# Altium project MainBoard.PrjPcb
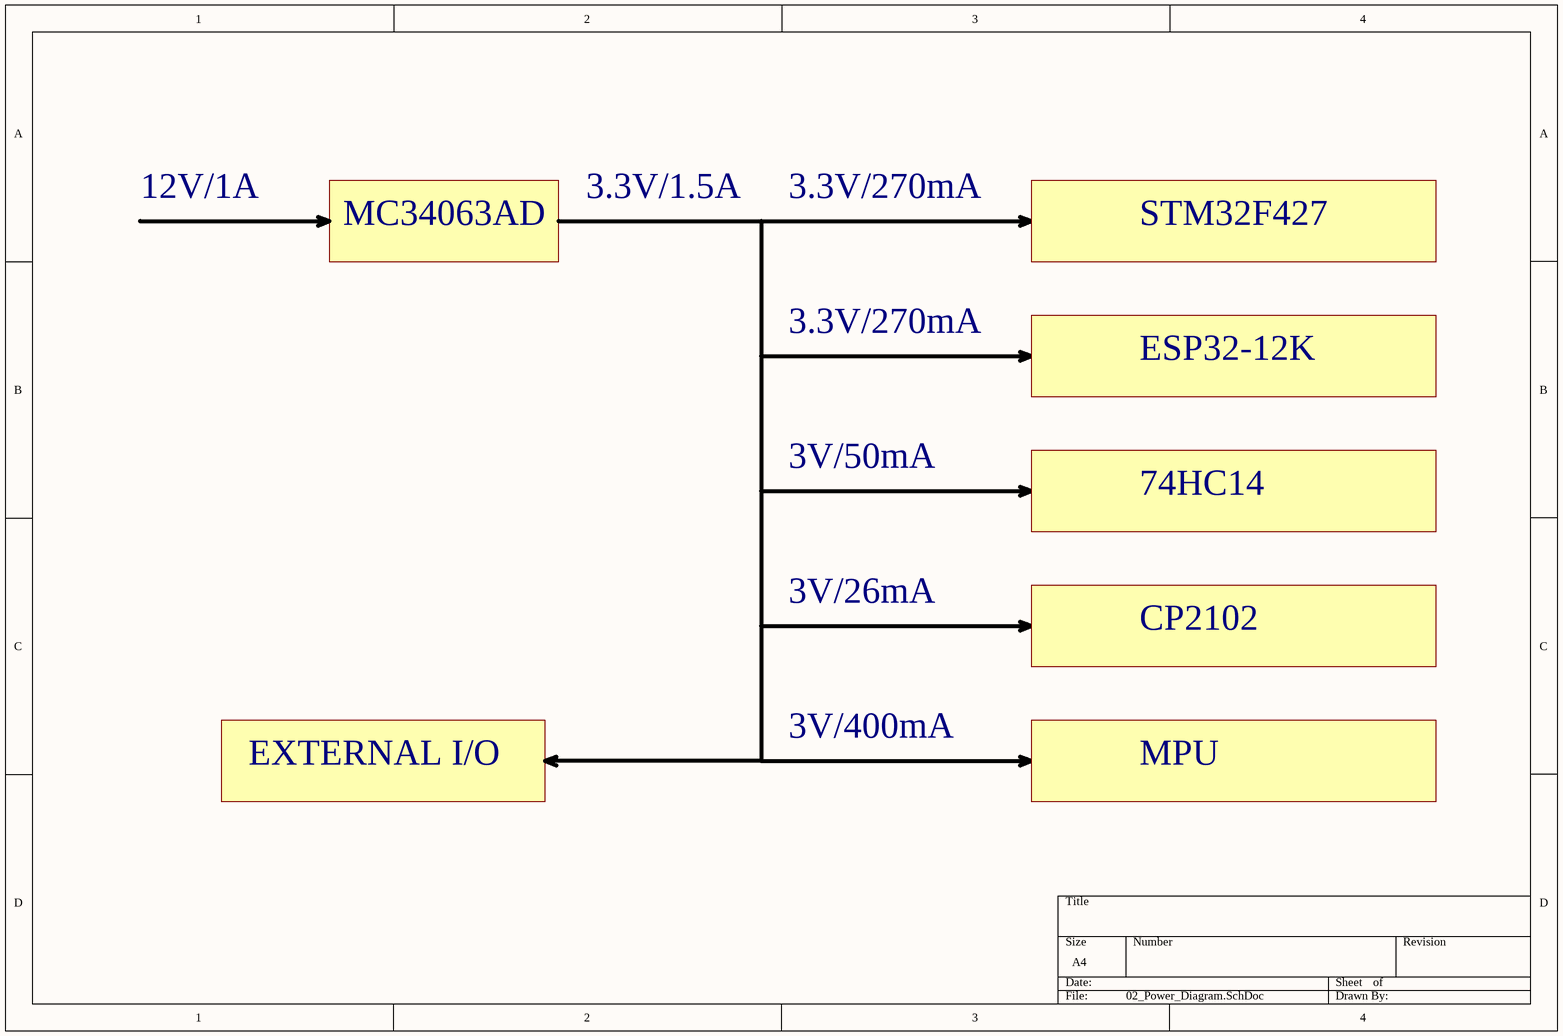
[diagram p0: 02_Power_Diagram.SchDoc]
9 sheets, 197 parts. Net scope: flat (ports and power ports of the same name join across sheets).
Board file: v1.0.PcbDoc
Sheets:
  02_Power_Diagram.SchDoc
  03_MCU_ESP32_Interface.SchDoc
  04_ESP32_UART.SchDoc
  05_MCU_STM32F4_Interface.SchDoc
  06_STM43F4_UART.SchDoc
  07_Ethernet_Interface.SchDoc
  08_Power_Supply.SchDoc
  09_IO_Isolated_Interface.SchDoc
  10_CAN_Interface.SchDoc

## Sheet 02_Power_Diagram.SchDoc
size A4; SheetNumber: 1; SheetTotal: 8

### Notes on the sheet
- 12V/1A
- MC34063AD
- 3.3V/1.5A
- 3.3V/270mA
- STM32F427
- ESP32-12K
- 3V/50mA
- 74HC14
- 3V/26mA
- CP2102
- EXTERNAL I/O
- 3V/400mA
- MPU

## Sheet 03_MCU_ESP32_Interface.SchDoc
size A4; SheetNumber: 4; SheetTotal: 9
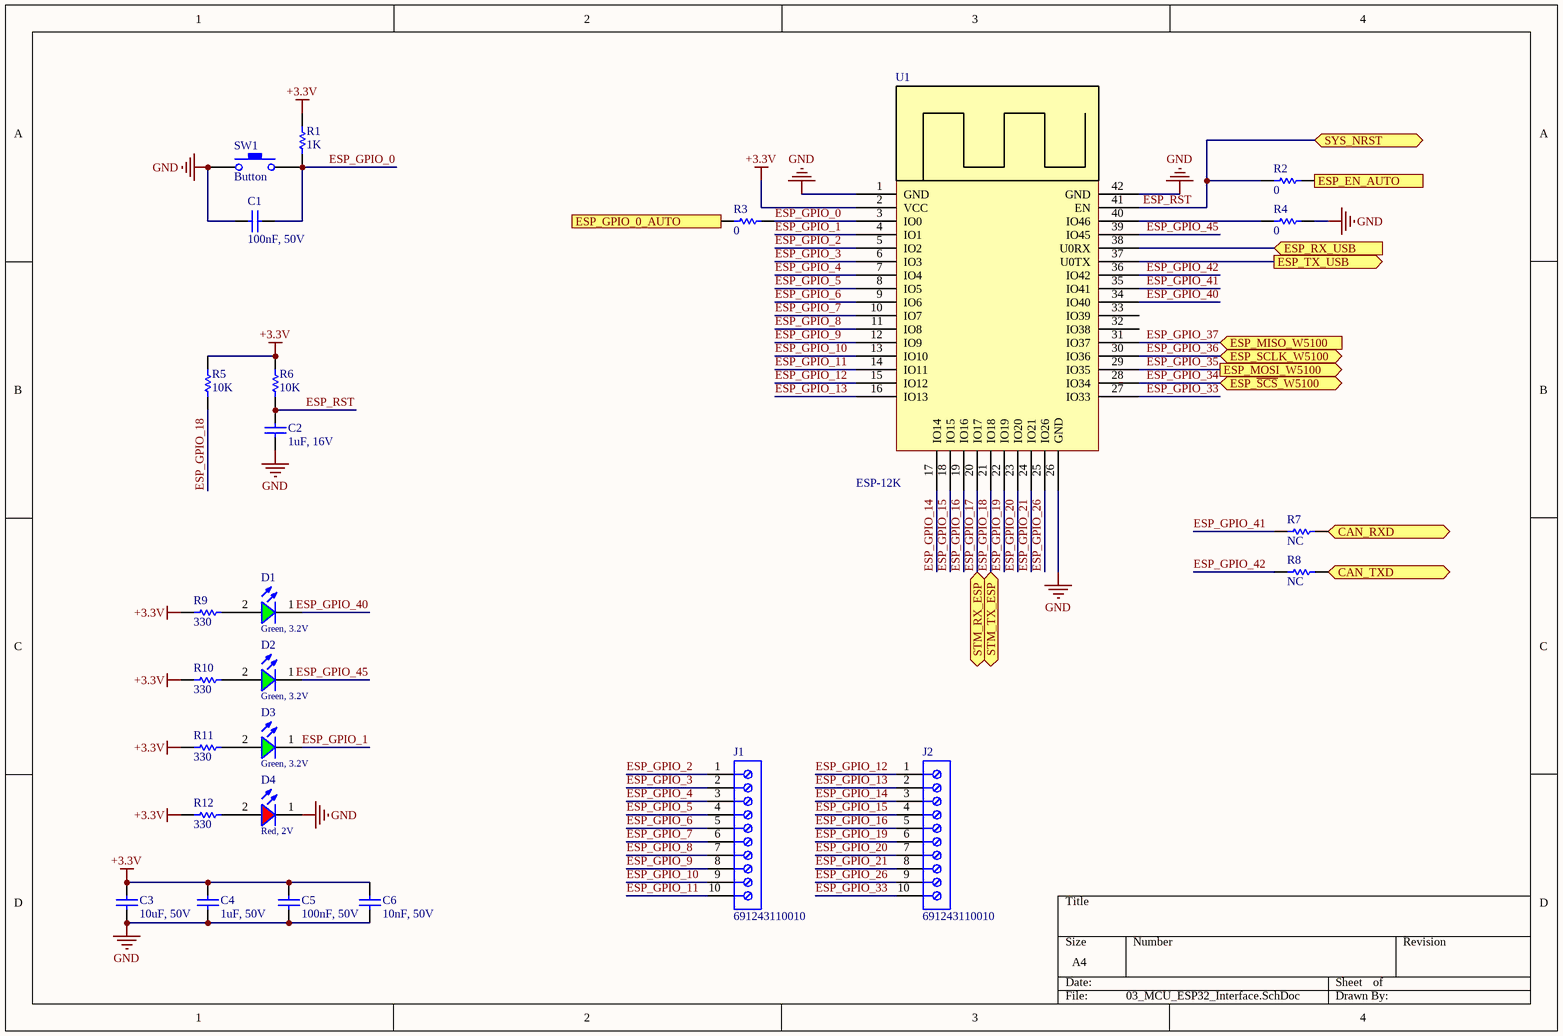
[diagram p1: 03_MCU_ESP32_Interface.SchDoc]

### Parts
C1  100nF, 50V  [WCAP-CSGP_0603_H=0.8mm_Reflow]
C2  1uF, 16V  [WCAP-CSGP_0603_H=0.8mm_Reflow]
C3  10uF, 50V  [WCAP-CSGP_0603_H=0.8mm_Reflow]
C4  1uF, 50V  [WCAP-CSGP_0603_H=0.8mm_Reflow]
C5  100nF, 50V  [WCAP-CSGP_0603_H=0.8mm_Reflow]
C6  10nF, 50V  [WCAP-CSGP_0603_H=0.8mm_Reflow]
D1  Green, 3.2V  [WL-SMCW_0603_H=0.7mm]
D2  Green, 3.2V  [WL-SMCW_0603_H=0.7mm]
D3  Green, 3.2V  [WL-SMCW_0603_H=0.7mm]
D4  Red, 2V  [WL-SMCW_0603_H=0.7mm]
J1  691243110010  [691243110010]
J2  691243110010  [691243110010]
R1  value 1K  [RES-SM-0603]  (hidden comment: RESISTOR SMD)
R2  value 0  [RES-SM-0603]  (hidden comment: RESISTOR SMD)
R3  value 0  [RES-SM-0603]  (hidden comment: RESISTOR SMD)
R4  value 0  [RES-SM-0603]  (hidden comment: RESISTOR SMD)
R5  value 10K  [RES-SM-0603]  (hidden comment: RESISTOR SMD)
R6  value 10K  [RES-SM-0603]  (hidden comment: RESISTOR SMD)
R7  value NC  [RES-SM-0603]  (hidden comment: RESISTOR SMD)
R8  value NC  [RES-SM-0603]  (hidden comment: RESISTOR SMD)
R9  value 330  [RES-SM-0603]  (hidden comment: RESISTOR SMD)
R10  value 330  [RES-SM-0603]  (hidden comment: RESISTOR SMD)
R11  value 330  [RES-SM-0603]  (hidden comment: RESISTOR SMD)
R12  value 330  [RES-SM-0603]  (hidden comment: RESISTOR SMD)
SW1  Button  [Button 4-pin SMD]
U1  ESP-12K  [CAC-150P3100X1800-41N]

### Ports
CAN_RXD (bidir), CAN_TXD (bidir), ESP_EN_AUTO (in), ESP_GPIO_0_AUTO (in), ESP_MISO_W5100 (in), ESP_MOSI_W5100 (out), ESP_RX_USB (in), ESP_SCLK_W5100 (bidir), ESP_TX_USB (out), ESP_~{SCS}_W5100 (bidir), STM_RX_ESP (bidir), STM_TX_ESP (bidir), SYS_NRST (bidir)

### Nets
+3.3V: C3.2 C4.2 C5.2 C6.2 R1.2 R5.2 R6.2 R9.2 R10.2 R11.2 R12.2 U1.2(VCC)
GND: C1.1 C2.1 C3.1 C4.1 C5.1 C6.1 D4.1(K) R4.2 SW1.1 U1.1(GND) U1.26(GND) U1.42(GND)
ESP_GPIO_0: C1.2 R1.1 R3.1 SW1.2 U1.3(IO0)
ESP_GPIO_1: D3.1(K) U1.4(IO1)
ESP_GPIO_2: J1.1 U1.5(IO2)
ESP_GPIO_3: J1.2 U1.6(IO3)
ESP_GPIO_4: J1.3 U1.7(IO4)
ESP_GPIO_5: J1.4 U1.8(IO5)
ESP_GPIO_6: J1.5 U1.9(IO6)
ESP_GPIO_7: J1.6 U1.10(IO7)
ESP_GPIO_8: J1.7 U1.11(IO8)
ESP_GPIO_9: J1.8 U1.12(IO9)
ESP_GPIO_10: J1.9 U1.13(IO10)
ESP_GPIO_11: J1.10 U1.14(IO11)
ESP_GPIO_12: J2.1 U1.15(IO12)
ESP_GPIO_13: J2.2 U1.16(IO13)
ESP_GPIO_14: J2.3 U1.17(IO14)
ESP_GPIO_15: J2.4 U1.18(IO15)
ESP_GPIO_16: J2.5 U1.19(IO16)
ESP_GPIO_17: U1.20(IO17) ; port STM_RX_ESP
ESP_GPIO_18: R5.1 U1.21(IO18) ; port STM_TX_ESP
ESP_GPIO_19: J2.6 U1.22(IO19)
ESP_GPIO_20: J2.7 U1.23(IO20)
ESP_GPIO_21: J2.8 U1.24(IO21)
ESP_GPIO_26: J2.9 U1.25(IO26)
ESP_GPIO_33: J2.10 U1.27(IO33)
ESP_GPIO_34: U1.28(IO34) ; port ESP_~{SCS}_W5100
ESP_GPIO_35: U1.29(IO35) ; port ESP_MOSI_W5100
ESP_GPIO_36: U1.30(IO36) ; port ESP_SCLK_W5100
ESP_GPIO_37: U1.31(IO37) ; port ESP_MISO_W5100
ESP_GPIO_40: D1.1(K) U1.34(IO40)
ESP_GPIO_41: R7.1 U1.35(IO41)
ESP_GPIO_42: R8.1 U1.36(IO42)
ESP_GPIO_45: D2.1(K) U1.39(IO45)
ESP_RST: C2.2 R2.1 R6.1 U1.41(EN) ; port SYS_NRST
NetD1_2: D1.2(A) R9.1
NetD2_2: D2.2(A) R10.1
NetD3_2: D3.2(A) R11.1
NetD4_2: D4.2(A) R12.1
NetR2_2: R2.2 ; port ESP_EN_AUTO
NetR3_2: R3.2 ; port ESP_GPIO_0_AUTO
NetR4_1: R4.1 U1.40(IO46)
NetR7_2: R7.2 ; port CAN_RXD
NetR8_2: R8.2 ; port CAN_TXD
NetU1_37: U1.37(U0TX) ; port ESP_TX_USB
NetU1_38: U1.38(U0RX) ; port ESP_RX_USB

Not connected (* = marked no-connect by the designer): U1 32(IO38) 33(IO39)

### Library data of the parts
C1 C3-C5 = 885012206095: WCAP-CSGP Multilayer Ceramic Chip Capacitor, General Purpose, size 0603, X7R, 100nF, 50V; Manufacturer: Wurth Elektronik; Rated Voltage: 50VDC; Isolation Resistance: >=5GOhm; Capacitance Tolerance: +/-10%; Technical Reference: X7R0603104K050DFCT10000; ComponentLink1Description: Manufacturer; ComponentLink1URL: http://www.we-online.de; ComponentLink2Description: Datasheet; ComponentLink2URL: https://www.we-online.com/catalog/datasheet/885012206095.pdf; Operating Temperature: -55 to +125degC; Packaging: Tape and Reel; Manufacturer Part Number: 885012206095; Published Date: May 2020; Ceramic Type: X7R; Dissipation Factor: =<3%; Height: 0.8mm; Mounting Technology: SMT; Size: 0603; Capacitance: 100nF
C2 = 885012106017: WCAP-CSGP Multilayer Ceramic Chip Capacitor, General Purpose, size 0603, X5R, 1uF, 16V; Manufacturer: Wurth Elektronik; Rated Voltage: 16VDC; Isolation Resistance: >=0.1GOhm; Capacitance Tolerance: +/-20%; Technical Reference: X5R0603105M016DFCT10000; ComponentLink1Description: Manufacturer; ComponentLink1URL: http://www.we-online.de; ComponentLink2Description: Datasheet; ComponentLink2URL: https://www.we-online.com/catalog/datasheet/885012106017.pdf; Operating Temperature: -55 to +85degC; Packaging: Tape and Reel; Manufacturer Part Number: 885012106017; Published Date: May 2020; Ceramic Type: X5R; Dissipation Factor: =<10%; Height: 0.8mm; Mounting Technology: SMT; Size: 0603; Capacitance: 1uF
C6 = 885012206089: WCAP-CSGP Multilayer Ceramic Chip Capacitor, General Purpose, size 0603, X7R, 10nF, 50V; Manufacturer: Wurth Elektronik; Rated Voltage: 50VDC; Isolation Resistance: >=10GOhm; Capacitance Tolerance: +/-10%; Technical Reference: X7R0603103K050DFCT10000; ComponentLink1Description: Manufacturer; ComponentLink1URL: http://www.we-online.de; ComponentLink2Description: Datasheet; ComponentLink2URL: https://www.we-online.com/catalog/datasheet/885012206089.pdf; Operating Temperature: -55 to +125degC; Packaging: Tape and Reel; Manufacturer Part Number: 885012206089; Published Date: May 2020; Ceramic Type: X7R; Dissipation Factor: =<2.5%; Height: 0.8mm; Mounting Technology: SMT; Size: 0603; Capacitance: 10nF
D1-D3 = 150060GS75000: WL-SMCW SMT Mono-color Chip LED Waterclear, size 0603, Green, 3.2V, 140deg; Chip Technology: InGaN; Dominant Wavelength typ.: 525nm; Luminous Intensity typ.: 430mcd; Peak Wavelength typ.: 515nm; Viewing Angle: 140deg; ComponentLink1Description: Manufacturer; ComponentLink1URL: http://www.we-online.de; ComponentLink2URL: https://www.we-online.com/catalog/datasheet/150060GS75000.pdf; ComponentLink2Description: Datasheet; Forward Voltage typ.: 3.2V; Emitting Color: Green; Mounting Technology: SMT; Operating Temperature: -40 to +85degC; Published Date: December 2019; Part Number: 150060GS75000; Packaging: Tape and Reel; Size: 0603; Publisher: Wurth Elektronik
D4 = 150060RS75000: WL-SMCW SMT Mono-color Chip LED Waterclear, size 0603, Red, 2V, 140deg; Chip Technology: AlInGaP; Dominant Wavelength typ.: 625nm; Luminous Intensity typ.: 250mcd; Peak Wavelength typ.: 630nm; Viewing Angle: 140deg; ComponentLink1Description: Manufacturer; ComponentLink1URL: http://www.we-online.de; ComponentLink2URL: https://www.we-online.com/catalog/datasheet/150060RS75000.pdf; ComponentLink2Description: Datasheet; Forward Voltage typ.: 2V; Emitting Color: Red; Mounting Technology: SMT; Operating Temperature: -40 to +85degC; Published Date: December 2019; Part Number: 150060RS75000; Packaging: Tape and Reel; Size: 0603; Publisher: Wurth Elektronik
J1 J2 = 691243110010: WR-TBL Serie 2431 Horizontal Cable Entry, Rising Cage Clamp, pitch 3.5mm, 10p; Compliance: Lead free / RoHS; Modularity: No; PCB/Cable/Panel: PCB; Pin Number: 10; Rated Current [UL]: 10A; Working Voltage [UL]: 300VAC; ComponentLink1Description: Manufacturer; ComponentLink1URL: http://www.we-online.de; ComponentLink2URL: https://katalog.we-online.de/em/datasheet/691243110010.pdf; ComponentLink2Description: Datasheet; Mounting Technology: THT; Part Number: 691243110010; Packaging: Box; Operating Temperature: -30 to +120degC; Pitch: 3.5mm; Published Date: October 2019; Type: Horizontal; Publisher: Wurth Elektronik; Application: Rising Cage Clamp
R1-R12 = RESISTOR SMD: Resistor
U1 = ESP-12K: ESP32-S2

## Sheet 04_ESP32_UART.SchDoc
size A4; SheetNumber: 3; SheetTotal: 7
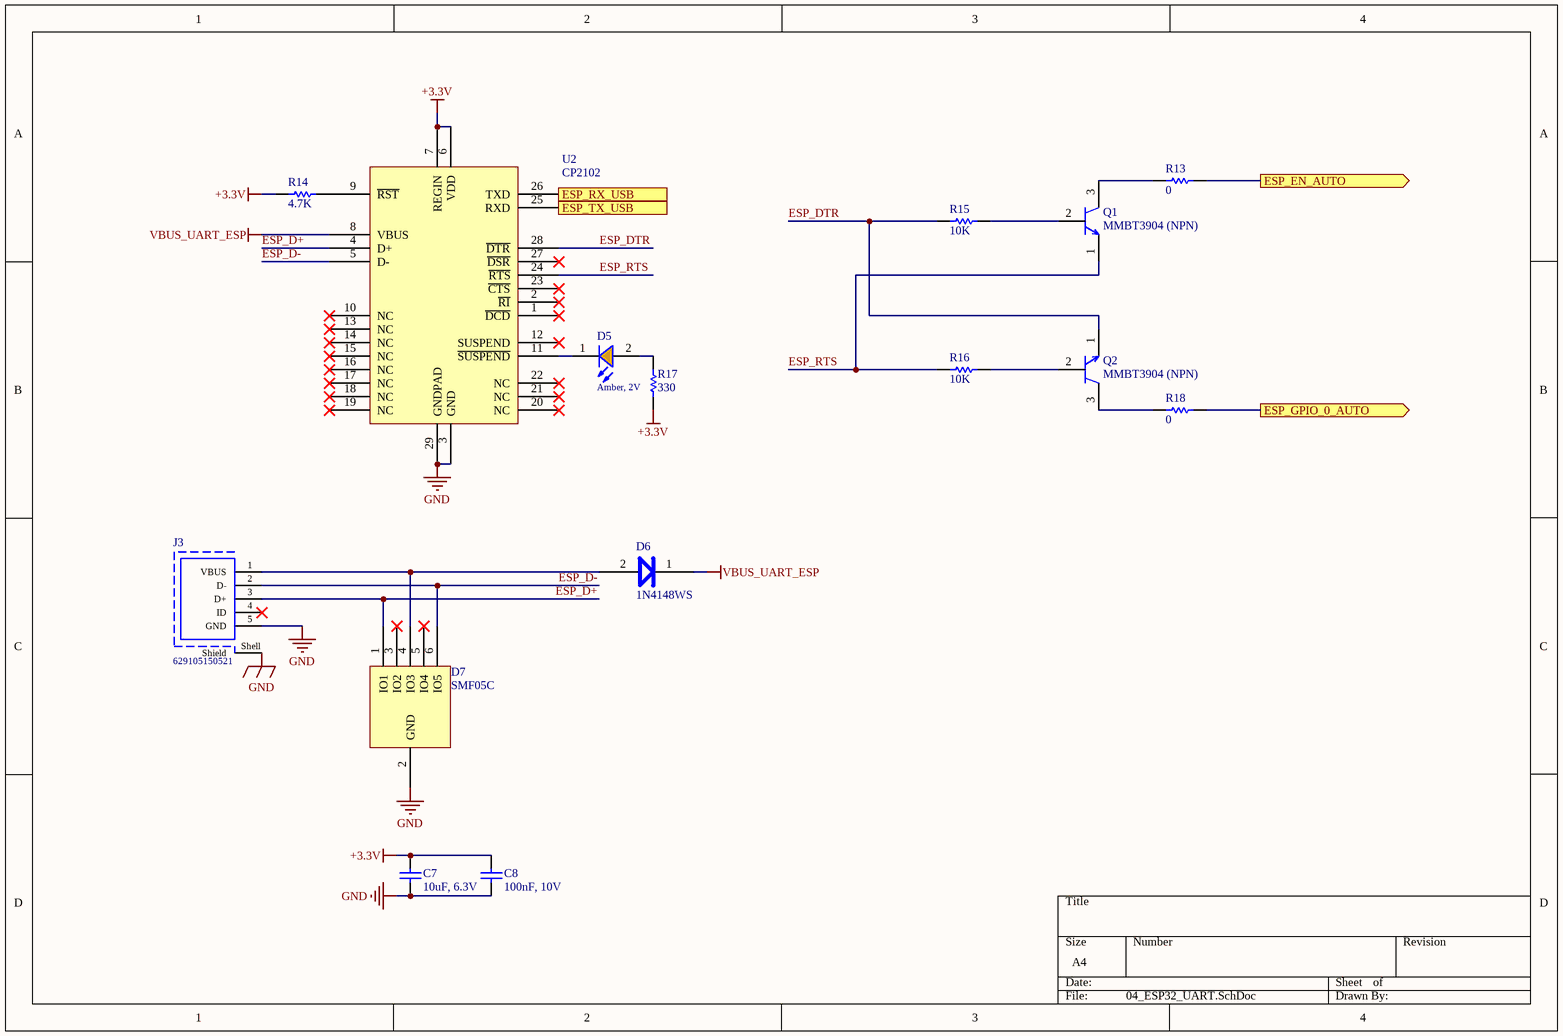
[diagram p2: 04_ESP32_UART.SchDoc]

### Parts
C7  10uF, 6.3V  [WCAP-CSGP_0603_H=0.8mm_Reflow]
C8  100nF, 10V  [WCAP-CSGP_0603_H=0.8mm_Reflow]
D5  Amber, 2V  [WL-SMCW_0603_H=0.7mm]
D6  1N4148WS  [SODFL250X90-2N]
D7  SMF05C  [SOT65P210X110-6N]
J3  629105150521  [629105150521]
Q1  MMBT3904 (NPN)  [SOT95P245X110-3N]
Q2  MMBT3904 (NPN)  [SOT95P245X110-3N]
R13  value 0  [RES-SM-0603]  (hidden comment: RESISTOR SMD)
R14  value 4.7K  [RES-SM-0603]  (hidden comment: RESISTOR SMD)
R15  value 10K  [RES-SM-0603]  (hidden comment: RESISTOR SMD)
R16  value 10K  [RES-SM-0603]  (hidden comment: RESISTOR SMD)
R17  value 330  [RES-SM-0603]  (hidden comment: RESISTOR SMD)
R18  value 0  [RES-SM-0603]  (hidden comment: RESISTOR SMD)
U2  CP2102  [QFN50P500X500X90_HS-29N]

### Ports
ESP_EN_AUTO (out), ESP_GPIO_0_AUTO (out), ESP_RX_USB (out), ESP_TX_USB (in)

### Nets
+3.3V: C7.2 C8.2 R14.2 R17.2 U2.6(VDD) U2.7(REGIN)
GND: C7.1 C8.1 D7.2(GND) J3.5(GND) J3.Shell(Shield) U2.3(GND) U2.29(GNDPAD)
VBUS_UART_ESP: D6.1 U2.8(VBUS)
ESP_D+: D7.1(IO1) J3.3(D+) U2.4(D+)
ESP_D-: D7.6(IO5) J3.2(D-) U2.5(D-)
ESP_DTR: Q2.1 R15.1 U2.28(~{DTR})
ESP_RTS: Q1.1 R16.1 U2.24(~{RTS})
NetD5_1: D5.1(K) U2.11(~{SUSPEND})
NetD5_2: D5.2(A) R17.1
NetD6_2: D6.2 D7.4(IO3) J3.1(VBUS)
NetQ1_2: Q1.2 R15.2
NetQ1_3: Q1.3 R13.1
NetQ2_2: Q2.2 R16.2
NetQ2_3: Q2.3 R18.1
NetR2_2: R13.2 ; port ESP_EN_AUTO
NetR3_2: R18.2 ; port ESP_GPIO_0_AUTO
NetR14_1: R14.1 U2.9(~{RST})
NetU1_37: U2.25(RXD) ; port ESP_TX_USB
NetU1_38: U2.26(TXD) ; port ESP_RX_USB

Not connected (* = marked no-connect by the designer): D7 3(IO2)* 5(IO4)*; J3 4(ID)*; U2 1(~{DCD})* 2(~{RI})* 10(NC)* 12(SUSPEND)* 13(NC)* 14(NC)* 15(NC)* 16(NC)* 17(NC)* 18(NC)* 19(NC)* 20(NC)* 21(NC)* 22(NC)* 23(~{CTS})* 27(~{DSR})*

### Library data of the parts
C7 = 885012106006: WCAP-CSGP Multilayer Ceramic Chip Capacitor, General Purpose, size 0603, X5R, 10uF, 6.3V; Manufacturer: Wurth Elektronik; Rated Voltage: 6.3VDC; Isolation Resistance: >=0.01GOhm; Capacitance Tolerance: +/-20%; Technical Reference: X5R0603106M6R3DFCT10000; ComponentLink1Description: Manufacturer; ComponentLink1URL: http://www.we-online.de; ComponentLink2Description: Datasheet; ComponentLink2URL: https://www.we-online.com/catalog/datasheet/885012106006.pdf; Operating Temperature: -55 to +85degC; Packaging: Tape and Reel; Manufacturer Part Number: 885012106006; Published Date: May 2020; Ceramic Type: X5R; Dissipation Factor: =<10%; Height: 0.8mm; Mounting Technology: SMT; Size: 0603; Capacitance: 10uF
C8 = 885012206020: WCAP-CSGP Multilayer Ceramic Chip Capacitor, General Purpose, size 0603, X7R, 100nF, 10V; Manufacturer: Wurth Elektronik; Rated Voltage: 10VDC; Isolation Resistance: >=5GOhm; Capacitance Tolerance: +/-10%; Technical Reference: X7R0603104K010DFCT10000; ComponentLink1Description: Manufacturer; ComponentLink1URL: http://www.we-online.de; ComponentLink2Description: Datasheet; ComponentLink2URL: https://www.we-online.com/catalog/datasheet/885012206020.pdf; Operating Temperature: -55 to +125degC; Packaging: Tape and Reel; Manufacturer Part Number: 885012206020; Published Date: May 2020; Ceramic Type: X7R; Dissipation Factor: =<5%; Height: 0.8mm; Mounting Technology: SMT; Size: 0603; Capacitance: 100nF
D5 = 150060AS75000: WL-SMCW SMT Mono-color Chip LED Waterclear, size 0603, Amber, 2V, 140deg; Chip Technology: AlInGaP; Dominant Wavelength typ.: 605nm; Luminous Intensity typ.: 130mcd; Peak Wavelength typ.: 610nm; Viewing Angle: 140deg; ComponentLink1Description: Manufacturer; ComponentLink1URL: http://www.we-online.de; ComponentLink2URL: https://www.we-online.com/catalog/datasheet/150060AS75000.pdf; ComponentLink2Description: Datasheet; Forward Voltage typ.: 2V; Emitting Color: Amber; Mounting Technology: SMT; Operating Temperature: -40 to +85degC; Published Date: December 2019; Part Number: 150060AS75000; Packaging: Tape and Reel; Size: 0603; Publisher: Wurth Elektronik
J3 = 629105150521: Micro USB 2.0 Type B Receptacle WR-COM, Horizontal, SMT, with Pegs, High Current at Pin 1 & Pin 5; Rated Current: 3 A; Contact Resistance: 30 mOhm; Working Voltage: 30 VAC; ComponentLink1Description: Manufacturer; ComponentLink1URL: http://www.we-online.de; ComponentLink2Description: Datasheet; ComponentLink2URL: https://katalog.we-online.de/em/datasheet/629105150521.pdf; Part Number: 629105150521; Published Date: September 2018; Publisher: Wurth Elektronik; Orientation: Horizontal; Connector Type: Micro USB 2.0 Type B; Operating Temperature: -40 to 85 degC; Mounting Technology: SMT; Gender: Receptacle; Packaging: Tape and Reel
Q1 Q2 = MMBT3904 (NPN): Manufacturer: On Semiconductor; ComponentLink1Description: Local link; ComponentLink1URL: https://www.thegioiic.com/products/mmbt3904-1am; Local supplier: thegioiic; Local supplier PN: MMBT3904-1AM; Manufacturer P/N: MMBT3904
R13-R18 = RESISTOR SMD: Resistor

## Sheet 05_MCU_STM32F4_Interface.SchDoc
size A4; SheetNumber: 5; SheetTotal: 9
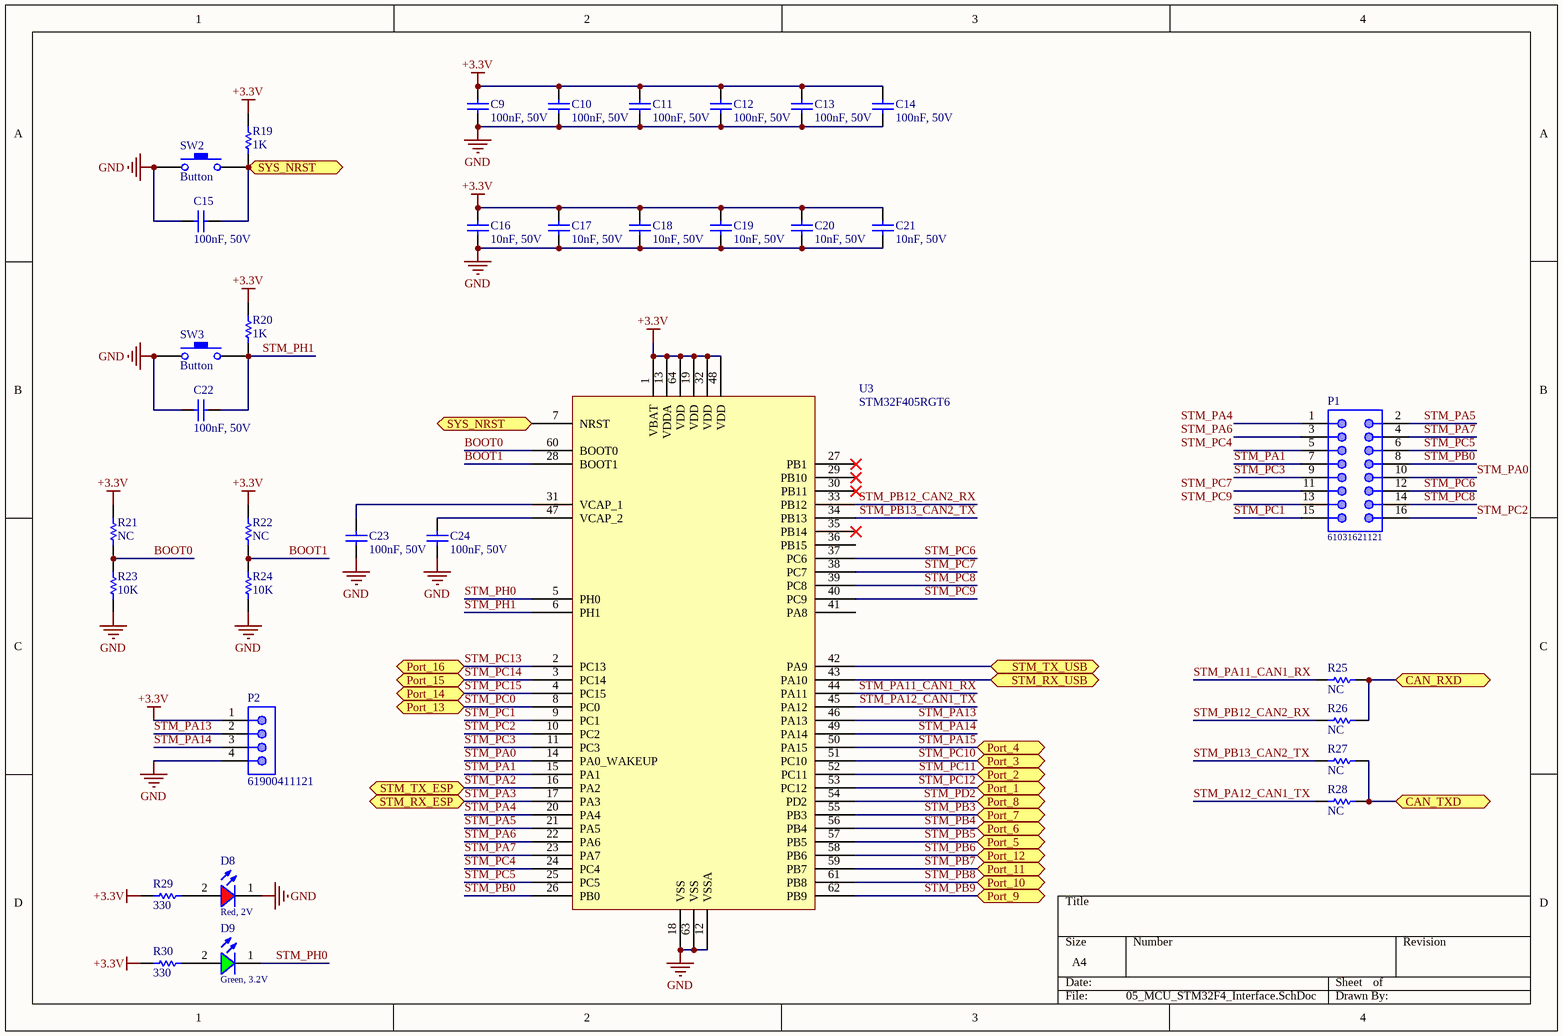
[diagram p3: 05_MCU_STM32F4_Interface.SchDoc]

### Parts
C9  100nF, 50V  [WCAP-CSGP_0603_H=0.8mm_Reflow]
C10  100nF, 50V  [WCAP-CSGP_0603_H=0.8mm_Reflow]
C11  100nF, 50V  [WCAP-CSGP_0603_H=0.8mm_Reflow]
C12  100nF, 50V  [WCAP-CSGP_0603_H=0.8mm_Reflow]
C13  100nF, 50V  [WCAP-CSGP_0603_H=0.8mm_Reflow]
C14  100nF, 50V  [WCAP-CSGP_0603_H=0.8mm_Reflow]
C15  100nF, 50V  [WCAP-CSGP_0603_H=0.8mm_Reflow]
C16  10nF, 50V  [WCAP-CSGP_0603_H=0.8mm_Reflow]
C17  10nF, 50V  [WCAP-CSGP_0603_H=0.8mm_Reflow]
C18  10nF, 50V  [WCAP-CSGP_0603_H=0.8mm_Reflow]
C19  10nF, 50V  [WCAP-CSGP_0603_H=0.8mm_Reflow]
C20  10nF, 50V  [WCAP-CSGP_0603_H=0.8mm_Reflow]
C21  10nF, 50V  [WCAP-CSGP_0603_H=0.8mm_Reflow]
C22  100nF, 50V  [WCAP-CSGP_0603_H=0.8mm_Reflow]
C23  100nF, 50V  [WCAP-CSGP_0603_H=0.8mm_Reflow]
C24  100nF, 50V  [WCAP-CSGP_0603_H=0.8mm_Reflow]
D8  Red, 2V  [WL-SMCW_0603_H=0.7mm]
D9  Green, 3.2V  [WL-SMCW_0603_H=0.7mm]
P1  61031621121  [61031621121]
P2  61900411121  [61900411121]
R19  value 1K  [RES-SM-0603]  (hidden comment: RESISTOR SMD)
R20  value 1K  [RES-SM-0603]  (hidden comment: RESISTOR SMD)
R21  value NC  [RES-SM-0603]  (hidden comment: RESISTOR SMD)
R22  value NC  [RES-SM-0603]  (hidden comment: RESISTOR SMD)
R23  value 10K  [RES-SM-0603]  (hidden comment: RESISTOR SMD)
R24  value 10K  [RES-SM-0603]  (hidden comment: RESISTOR SMD)
R25  value NC  [RES-SM-0603]  (hidden comment: RESISTOR SMD)
R26  value NC  [RES-SM-0603]  (hidden comment: RESISTOR SMD)
R27  value NC  [RES-SM-0603]  (hidden comment: RESISTOR SMD)
R28  value NC  [RES-SM-0603]  (hidden comment: RESISTOR SMD)
R29  value 330  [RES-SM-0603]  (hidden comment: RESISTOR SMD)
R30  value 330  [RES-SM-0603]  (hidden comment: RESISTOR SMD)
SW2  Button  [Button 4-pin SMD]
SW3  Button  [Button 4-pin SMD]
U3  STM32F405RGT6  [CQFP50P1150X1150X160-64N]

### Ports
CAN_RXD (bidir), CAN_TXD (bidir), Port_1 (bidir), Port_2 (bidir), Port_3 (bidir), Port_4 (bidir), Port_5 (bidir), Port_6 (bidir), Port_7 (bidir), Port_8 (bidir), Port_9 (bidir), Port_10 (bidir), Port_11 (bidir), Port_12 (bidir), Port_13 (bidir), Port_14 (bidir), Port_15 (bidir), Port_16 (bidir), STM_RX_ESP (bidir), STM_RX_USB (bidir), STM_TX_ESP (bidir), STM_TX_USB (bidir), SYS_NRST (bidir)

### Nets
+3.3V: C9.2 C10.2 C11.2 C12.2 C13.2 C14.2 C16.2 C17.2 C18.2 C19.2 C20.2 C21.2 P2.1 R19.2 R20.2 R21.2 R22.2 R29.2 R30.2 U3.1(VBAT) U3.13(VDDA) U3.19(VDD) U3.32(VDD) U3.48(VDD) U3.64(VDD)
GND: C9.1 C10.1 C11.1 C12.1 C13.1 C14.1 C15.1 C16.1 C17.1 C18.1 C19.1 C20.1 C21.1 C22.1 C23.1 C24.1 D8.1(K) P2.4 R23.1 R24.1 SW2.1 SW3.1 U3.12(VSSA) U3.18(VSS) U3.63(VSS)
BOOT0: R21.1 R23.2 U3.60(BOOT0)
BOOT1: R22.1 R24.2 U3.28(BOOT1)
ESP_RST: C15.2 R19.1 SW2.2 U3.7(NRST) ; port SYS_NRST
STM_PA0: P1.10 U3.14(PA0_WAKEUP)
STM_PA1: P1.7 U3.15(PA1)
STM_PA2: U3.16(PA2) ; port STM_TX_ESP  [project net ESP_GPIO_18]
STM_PA3: U3.17(PA3) ; port STM_RX_ESP  [project net ESP_GPIO_17]
STM_PA4: P1.1 U3.20(PA4)
STM_PA5: P1.2 U3.21(PA5)
STM_PA6: P1.3 U3.22(PA6)
STM_PA7: P1.4 U3.23(PA7)
STM_PA11_CAN1_RX: R25.1 U3.44(PA11)
STM_PA12_CAN1_TX: R28.1 U3.45(PA12)
STM_PA13: P2.2 U3.46(PA13)
STM_PA14: P2.3 U3.49(PA14)
STM_PA15: U3.50(PA15) ; port Port_4
STM_PB0: P1.8 U3.26(PB0)
STM_PB3: U3.55(PB3) ; port Port_7
STM_PB4: U3.56(PB4) ; port Port_6
STM_PB5: U3.57(PB5) ; port Port_5
STM_PB6: U3.58(PB6) ; port Port_12
STM_PB7: U3.59(PB7) ; port Port_11
STM_PB8: U3.61(PB8) ; port Port_10
STM_PB9: U3.62(PB9) ; port Port_9
STM_PB12_CAN2_RX: R26.1 U3.33(PB12)
STM_PB13_CAN2_TX: R27.1 U3.34(PB13)
STM_PC0: U3.8(PC0) ; port Port_13
STM_PC1: P1.15 U3.9(PC1)
STM_PC2: P1.16 U3.10(PC2)
STM_PC3: P1.9 U3.11(PC3)
STM_PC4: P1.5 U3.24(PC4)
STM_PC5: P1.6 U3.25(PC5)
STM_PC6: P1.12 U3.37(PC6)
STM_PC7: P1.11 U3.38(PC7)
STM_PC8: P1.14 U3.39(PC8)
STM_PC9: P1.13 U3.40(PC9)
STM_PC10: U3.51(PC10) ; port Port_3
STM_PC11: U3.52(PC11) ; port Port_2
STM_PC12: U3.53(PC12) ; port Port_1
STM_PC13: U3.2(PC13) ; port Port_16
STM_PC14: U3.3(PC14) ; port Port_15
STM_PC15: U3.4(PC15) ; port Port_14
STM_PD2: U3.54(PD2) ; port Port_8
STM_PH0: D9.1(K) U3.5(PH0)
STM_PH1: C22.2 R20.1 SW3.2 U3.6(PH1)
NetC23_2: C23.2 U3.31(VCAP_1)
NetC24_2: C24.2 U3.47(VCAP_2)
NetD8_2: D8.2(A) R29.1
NetD9_2: D9.2(A) R30.1
NetD10_1: U3.42(PA9) ; port STM_TX_USB
NetD11_1: U3.43(PA10) ; port STM_RX_USB
NetR7_2: R25.2 R26.2 ; port CAN_RXD
NetR8_2: R27.2 R28.2 ; port CAN_TXD

Not connected (* = marked no-connect by the designer): U3 27(PB1)* 29(PB10)* 30(PB11)* 35(PB14)* 36(PB15) 41(PA8)

### Library data of the parts
C9-C15 C22-C24 = 885012206095: as C1 on sheet 03_MCU_ESP32_Interface; ComponentLink1Description: Manufacturer; ComponentLink1URL: http://www.we-online.de; ComponentLink2Description: Datasheet; ComponentLink2URL: https://www.we-online.com/catalog/datasheet/885012206095.pdf; Operating Temperature: -55 to +125degC; Packaging: Tape and Reel; Manufacturer Part Number: 885012206095; Published Date: May 2020; Ceramic Type: X7R; Dissipation Factor: =<3%; Height: 0.8mm; Mounting Technology: SMT; Size: 0603; Capacitance: 100nF
C16-C21 = 885012206089: as C6 on sheet 03_MCU_ESP32_Interface; ComponentLink1Description: Manufacturer; ComponentLink1URL: http://www.we-online.de; ComponentLink2Description: Datasheet; ComponentLink2URL: https://www.we-online.com/catalog/datasheet/885012206089.pdf; Operating Temperature: -55 to +125degC; Packaging: Tape and Reel; Manufacturer Part Number: 885012206089; Published Date: May 2020; Ceramic Type: X7R; Dissipation Factor: =<2.5%; Height: 0.8mm; Mounting Technology: SMT; Size: 0603; Capacitance: 10nF
D8 = 150060RS75000: as D4 on sheet 03_MCU_ESP32_Interface; Viewing Angle: 140deg; ComponentLink1Description: Manufacturer; ComponentLink1URL: http://www.we-online.de; ComponentLink2URL: https://www.we-online.com/catalog/datasheet/150060RS75000.pdf; ComponentLink2Description: Datasheet; Forward Voltage typ.: 2V; Emitting Color: Red; Mounting Technology: SMT; Operating Temperature: -40 to +85degC; Published Date: December 2019; Part Number: 150060RS75000; Packaging: Tape and Reel; Size: 0603; Publisher: Wurth Elektronik
D9 = 150060GS75000: as D1 on sheet 03_MCU_ESP32_Interface; Viewing Angle: 140deg; ComponentLink1Description: Manufacturer; ComponentLink1URL: http://www.we-online.de; ComponentLink2URL: https://www.we-online.com/catalog/datasheet/150060GS75000.pdf; ComponentLink2Description: Datasheet; Forward Voltage typ.: 3.2V; Emitting Color: Green; Mounting Technology: SMT; Operating Temperature: -40 to +85degC; Published Date: December 2019; Part Number: 150060GS75000; Packaging: Tape and Reel; Size: 0603; Publisher: Wurth Elektronik
P1 = 61031621121: WR-PHD Pin Header, SMT, pitch 2.54mm, Dual Row, Vertical, 16p; Manufacturer: Wurth Elektronik; Pin Number: 16; Rated Current: 3A; Working Voltage: 250VAC; Withstanding Voltage: 500VAC; Contact Resistance: 20mOhm; ComponentLink1Description: Manufacturer; ComponentLink1URL: http://www.we-online.de; ComponentLink2Description: Datasheet; ComponentLink2URL: https://www.we-online.com/catalog/datasheet/61031621121.pdf; Manufacturer Part Number: 61031621121; Published Date: May 2020; Pitch: 2.54mm; Operating Temperature: -40 to +125degC; Mounting Technology: SMT; Packaging: Tape and Reel; Gender: Pin Header; Row Number: Dual; Orientation: Vertical
P2 = 61900411121: WR-WTB THT Male Vertical Locking Header, pitch 2.54mm, 4p; Pin Number: 4; Contact Resistance: 20mOhm; Rated Current: 3A; Withstanding Voltage: 1000VAC; Working Voltage: 250VAC; ComponentLink1Description: Manufacturer; ComponentLink1URL: http://www.we-online.de; ComponentLink2Description: Datasheet; ComponentLink2URL: https://www.we-online.com/catalog/datasheet/61900411121.pdf; Pitch: 2.54mm; Published Date: January 2020; Publisher: Wurth Elektronik; Mounting Technology: THT; Packaging: Bag; Operating Temperature: -40 to +105degC; Part Number: 61900411121; Gender: Male; Type: Vertical
R19-R30 = RESISTOR SMD: Resistor
U3 = STM32F405RGT6: Manufacturer: ST; ComponentLink1Description: Supplier 1 Link

## Sheet 06_STM43F4_UART.SchDoc
size A4; SheetNumber: 7; SheetTotal: 7
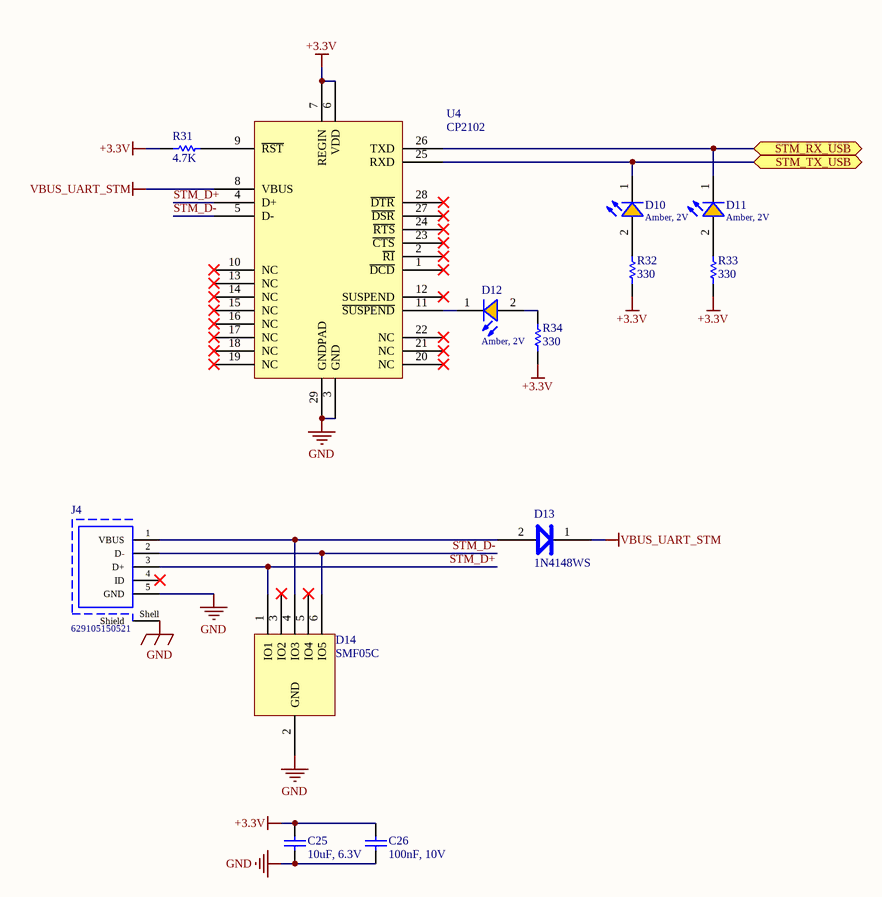
[diagram p4: 06_STM43F4_UART.SchDoc]

### Parts
C25  10uF, 6.3V  [WCAP-CSGP_0603_H=0.8mm_Reflow]
C26  100nF, 10V  [WCAP-CSGP_0603_H=0.8mm_Reflow]
D10  Amber, 2V  [WL-SMCW_0603_H=0.7mm]
D11  Amber, 2V  [WL-SMCW_0603_H=0.7mm]
D12  Amber, 2V  [WL-SMCW_0603_H=0.7mm]
D13  1N4148WS  [SODFL250X90-2N]
D14  SMF05C  [SOT65P210X110-6N]
J4  629105150521  [629105150521]
R31  value 4.7K  [RES-SM-0603]  (hidden comment: RESISTOR SMD)
R32  value 330  [RES-SM-0603]  (hidden comment: RESISTOR SMD)
R33  value 330  [RES-SM-0603]  (hidden comment: RESISTOR SMD)
R34  value 330  [RES-SM-0603]  (hidden comment: RESISTOR SMD)
U4  CP2102  [QFN50P500X500X90_HS-29N]

### Ports
STM_RX_USB (bidir), STM_TX_USB (bidir)

### Nets
+3.3V: C25.2 C26.2 R31.2 R32.2 R33.2 R34.2 U4.6(VDD) U4.7(REGIN)
GND: C25.1 C26.1 D14.2(GND) J4.5(GND) J4.Shell(Shield) U4.3(GND) U4.29(GNDPAD)
VBUS_UART_STM: D13.1 U4.8(VBUS)
STM_D+: D14.1(IO1) J4.3(D+) U4.4(D+)
STM_D-: D14.6(IO5) J4.2(D-) U4.5(D-)
NetD10_1: D10.1(K) U4.25(RXD) ; port STM_TX_USB
NetD10_2: D10.2(A) R32.1
NetD11_1: D11.1(K) U4.26(TXD) ; port STM_RX_USB
NetD11_2: D11.2(A) R33.1
NetD12_1: D12.1(K) U4.11(~{SUSPEND})
NetD12_2: D12.2(A) R34.1
NetD13_2: D13.2 D14.4(IO3) J4.1(VBUS)
NetR31_1: R31.1 U4.9(~{RST})

Not connected (* = marked no-connect by the designer): D14 3(IO2)* 5(IO4)*; J4 4(ID)*; U4 1(~{DCD})* 2(~{RI})* 10(NC)* 12(SUSPEND)* 13(NC)* 14(NC)* 15(NC)* 16(NC)* 17(NC)* 18(NC)* 19(NC)* 20(NC)* 21(NC)* 22(NC)* 23(~{CTS})* 24(~{RTS})* 27(~{DSR})* 28(~{DTR})*

### Library data of the parts
C25 = 885012106006: as C7 on sheet 04_ESP32_UART; ComponentLink1Description: Manufacturer; ComponentLink1URL: http://www.we-online.de; ComponentLink2Description: Datasheet; ComponentLink2URL: https://www.we-online.com/catalog/datasheet/885012106006.pdf; Operating Temperature: -55 to +85degC; Packaging: Tape and Reel; Manufacturer Part Number: 885012106006; Published Date: May 2020; Ceramic Type: X5R; Dissipation Factor: =<10%; Height: 0.8mm; Mounting Technology: SMT; Size: 0603; Capacitance: 10uF
C26 = 885012206020: as C8 on sheet 04_ESP32_UART; ComponentLink1Description: Manufacturer; ComponentLink1URL: http://www.we-online.de; ComponentLink2Description: Datasheet; ComponentLink2URL: https://www.we-online.com/catalog/datasheet/885012206020.pdf; Operating Temperature: -55 to +125degC; Packaging: Tape and Reel; Manufacturer Part Number: 885012206020; Published Date: May 2020; Ceramic Type: X7R; Dissipation Factor: =<5%; Height: 0.8mm; Mounting Technology: SMT; Size: 0603; Capacitance: 100nF
D10-D12 = 150060AS75000: as D5 on sheet 04_ESP32_UART; Viewing Angle: 140deg; ComponentLink1Description: Manufacturer; ComponentLink1URL: http://www.we-online.de; ComponentLink2URL: https://www.we-online.com/catalog/datasheet/150060AS75000.pdf; ComponentLink2Description: Datasheet; Forward Voltage typ.: 2V; Emitting Color: Amber; Mounting Technology: SMT; Operating Temperature: -40 to +85degC; Published Date: December 2019; Part Number: 150060AS75000; Packaging: Tape and Reel; Size: 0603; Publisher: Wurth Elektronik
J4 = 629105150521: as J3 on sheet 04_ESP32_UART; ComponentLink1Description: Manufacturer; ComponentLink1URL: http://www.we-online.de; ComponentLink2Description: Datasheet; ComponentLink2URL: https://katalog.we-online.de/em/datasheet/629105150521.pdf; Part Number: 629105150521; Published Date: September 2018; Publisher: Wurth Elektronik; Orientation: Horizontal; Connector Type: Micro USB 2.0 Type B; Operating Temperature: -40 to 85 degC; Mounting Technology: SMT; Gender: Receptacle; Packaging: Tape and Reel
R31-R34 = RESISTOR SMD: Resistor

## Sheet 07_Ethernet_Interface.SchDoc
size A4; SheetNumber: 4; SheetTotal: 7
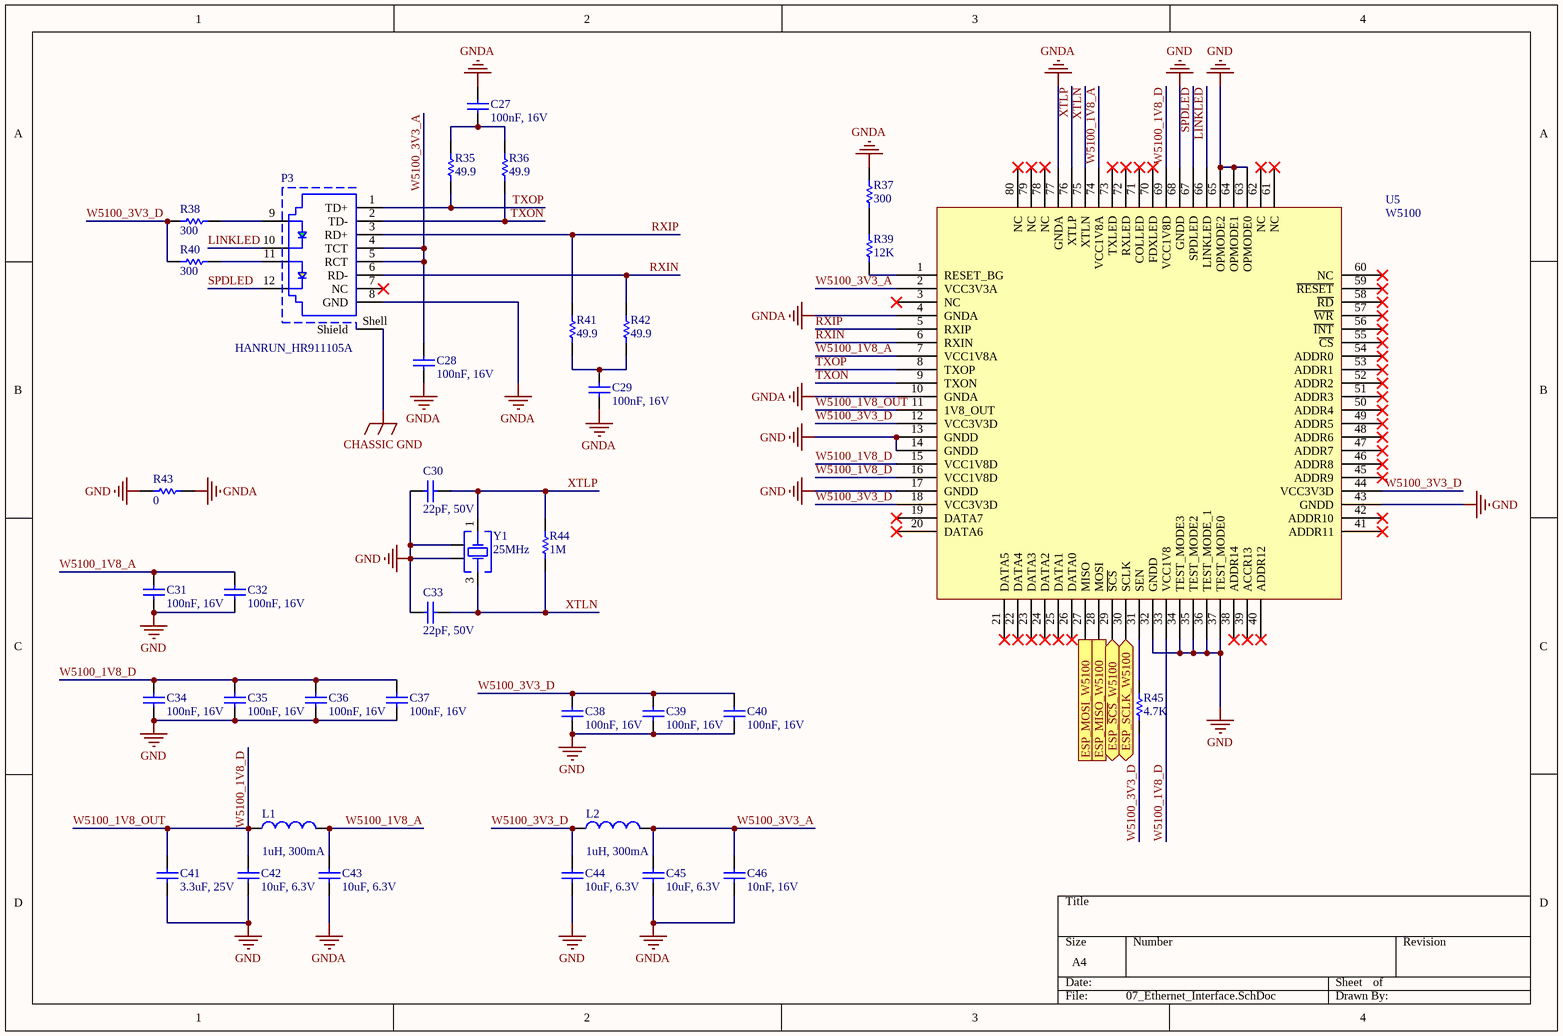
[diagram p5: 07_Ethernet_Interface.SchDoc]

### Parts
C27  100nF, 16V  [WCAP-CSGP_0603_H=0.8mm_Reflow]
C28  100nF, 16V  [WCAP-CSGP_0603_H=0.8mm_Reflow]
C29  100nF, 16V  [WCAP-CSGP_0603_H=0.8mm_Reflow]
C30  22pF, 50V  [WCAP-CSGP_0603_H=0.8mm_Reflow]
C31  100nF, 16V  [WCAP-CSGP_0603_H=0.8mm_Reflow]
C32  100nF, 16V  [WCAP-CSGP_0603_H=0.8mm_Reflow]
C33  22pF, 50V  [WCAP-CSGP_0603_H=0.8mm_Reflow]
C34  100nF, 16V  [WCAP-CSGP_0603_H=0.8mm_Reflow]
C35  100nF, 16V  [WCAP-CSGP_0603_H=0.8mm_Reflow]
C36  100nF, 16V  [WCAP-CSGP_0603_H=0.8mm_Reflow]
C37  100nF, 16V  [WCAP-CSGP_0603_H=0.8mm_Reflow]
C38  100nF, 16V  [WCAP-CSGP_0603_H=0.8mm_Reflow]
C39  100nF, 16V  [WCAP-CSGP_0603_H=0.8mm_Reflow]
C40  100nF, 16V  [WCAP-CSGP_0603_H=0.8mm_Reflow]
C41  3.3uF, 25V  [WCAP-CSGP_0805_H=1.25mm]
C42  10uF, 6.3V  [WCAP-CSGP_0603_H=0.8mm_Reflow]
C43  10uF, 6.3V  [WCAP-CSGP_0603_H=0.8mm_Reflow]
C44  10uF, 6.3V  [WCAP-CSGP_0603_H=0.8mm_Reflow]
C45  10uF, 6.3V  [WCAP-CSGP_0603_H=0.8mm_Reflow]
C46  10nF, 16V  [WCAP-CSGP_0603_H=0.8mm_Reflow]
L1  value 1uH, 300mA  [I0603]  (hidden comment: Inductor)
L2  value 1uH, 300mA  [I0603]  (hidden comment: Inductor)
P3  HANRUN_HR911105A  [HANRUN_HR911105A]
R35  value 49.9  [R0603]  (hidden comment: Resistor)
R36  value 49.9  [R0603]  (hidden comment: Resistor)
R37  value 300  [R0603]  (hidden comment: Resistor)
R38  value 300  [R0603]  (hidden comment: Resistor)
R39  value 12K  [R0603]  (hidden comment: Resistor)
R40  value 300  [R0603]  (hidden comment: Resistor)
R41  value 49.9  [R0603]  (hidden comment: Resistor)
R42  value 49.9  [R0603]  (hidden comment: Resistor)
R43  value 0  [R0603]  (hidden comment: Resistor)
R44  value 1M  [R0603]  (hidden comment: Resistor)
R45  value 4.7K  [R0603]  (hidden comment: Resistor)
U5  W5100  [CQFP40P1200X1200X160-80N]
Y1  25MHz  [WE-XTAL_CFPX-180]

### Ports
ESP_MISO_W5100 (out), ESP_MOSI_W5100 (in), ESP_SCLK_W5100 (bidir), ESP_~{SCS}_W5100 (bidir)

### Nets
CHASSIC GND: P3.Shell(Shield)
GND: C30.1 C31.1 C32.1 C33.1 C34.1 C35.1 C36.1 C37.1 C38.1 C39.1 C40.1 C41.1 C42.1 C44.1 R43.2 U5.13(GNDD) U5.14(GNDD) U5.17(GNDD) U5.32(GNDD) U5.34(TEST_MODE3) U5.35(TEST_MODE2) U5.36(TEST_MODE_1) U5.37(TEST_MODE0) U5.43(GNDD) U5.63(OPMODE0) U5.64(OPMODE1) U5.65(OPMODE2) U5.68(GNDD) Y1.2(GND&Lid) Y1.4(GND&Lid)
GNDA: C27.2 C28.1 C29.2 C43.1 C45.1 C46.1 P3.8(GND) R37.2 R43.1 U5.4(GNDA) U5.10(GNDA) U5.77(GNDA)
ESP_GPIO_34: U5.29(~{SCS}) ; port ESP_~{SCS}_W5100
ESP_GPIO_35: U5.27(MISO) ; port ESP_MOSI_W5100
ESP_GPIO_36: U5.30(SCLK) ; port ESP_SCLK_W5100
ESP_GPIO_37: U5.28(MOSI) ; port ESP_MISO_W5100
LINKLED: P3.10 U5.66(LINKLED)
RXIN: P3.6(RD-) R42.1 U5.6(RXIN)
RXIP: P3.3(RD+) R41.1 U5.5(RXIP)
SPDLED: P3.12 U5.67(SPDLED)
TXON: P3.2(TD-) R36.1 U5.9(TXON)
TXOP: P3.1(TD+) R35.1 U5.8(TXOP)
W5100_1V8_A: C31.2 C32.2 C43.2 L1.2 U5.7(VCC1V8A) U5.74(VCC1V8A)
W5100_1V8_D: C34.2 C35.2 C36.2 C37.2 C41.2 C42.2 L1.1 U5.11(1V8_OUT) U5.15(VCC1V8D) U5.16(VCC1V8D) U5.33(VCC1V8) U5.69(VCC1V8D)  [also labelled W5100_1V8_OUT]
W5100_3V3_A: C28.2 C45.2 C46.2 L2.2 P3.4(TCT) P3.5(RCT) U5.2(VCC3V3A)
W5100_3V3_D: C38.2 C39.2 C40.2 C44.2 L2.1 R38.2 R40.2 R45.1 U5.12(VCC3V3D) U5.18(VCC3V3D) U5.44(VCC3V3D)
XTLN: C33.2 R44.1 U5.75(XTLN) Y1.3(Crystal)
XTLP: C30.2 R44.2 U5.76(XTLP) Y1.1(Crystal)
NetC27_1: C27.1 R35.2 R36.2
NetC29_1: C29.1 R41.2 R42.2
NetP3_9: P3.9 R38.1
NetP3_11: P3.11 R40.1
NetR37_1: R37.1 R39.2
NetR39_1: R39.1 U5.1(RESET_BG)
NetR45_2: R45.2 U5.31(SEN)

Not connected (* = marked no-connect by the designer): P3 7(NC)*; U5 3(NC)* 19(DATA7)* 20(DATA6)* 21(DATA5)* 22(DATA4)* 23(DATA3)* 24(DATA2)* 25(DATA1)* 26(DATA0)* 38(ADDR14)* 39(ACCR13)* 40(ADDR12)* 41(ADDR11)* 42(ADDR10)* 45(ADDR9)* 46(ADDR8)* 47(ADDR7)* 48(ADDR6)* 49(ADDR5)* 50(ADDR4)* 51(ADDR3)* 52(ADDR2)* 53(ADDR1)* 54(ADDR0)* 55(~{CS})* 56(~{INT})* 57(~{WR})* 58(~{RD})* 59(~{RESET})* 60(NC)* 61(NC)* 62(NC)* 70(FDXLED)* 71(COLLED)* 72(RXLED)* 73(TXLED)* 78(NC)* 79(NC)* 80(NC)*

### Library data of the parts
C27-C29 C31 C32 C34-C40 = 885012206046: WCAP-CSGP Multilayer Ceramic Chip Capacitor, General Purpose, size 0603, X7R, 100nF, 16V; Manufacturer: Wurth Elektronik; Rated Voltage: 16VDC; Isolation Resistance: >=5GOhm; Capacitance Tolerance: +/-10%; Technical Reference: X7R0603104K016DFCT10000; ComponentLink1Description: Manufacturer; ComponentLink1URL: http://www.we-online.de; ComponentLink2Description: Datasheet; ComponentLink2URL: https://www.we-online.com/catalog/datasheet/885012206046.pdf; Operating Temperature: -55 to +125degC; Packaging: Tape and Reel; Manufacturer Part Number: 885012206046; Published Date: May 2020; Ceramic Type: X7R; Dissipation Factor: =<3.5%; Height: 0.8mm; Mounting Technology: SMT; Size: 0603; Capacitance: 100nF
C30 C33 = 885012006053: WCAP-CSGP Multilayer Ceramic Chip Capacitor, General Purpose, size 0603, NP0, 22pF, 50V; Manufacturer: Wurth Elektronik; Rated Voltage: 50VDC; Isolation Resistance: >=10GOhm; Capacitance Tolerance: +/-5%; Dissipation Factor: Q>=400+20C; Technical Reference: NP00603220J050DFCT10000; ComponentLink1Description: Manufacturer; ComponentLink1URL: http://www.we-online.de; ComponentLink2Description: Datasheet; ComponentLink2URL: https://www.we-online.com/catalog/datasheet/885012006053.pdf; Operating Temperature: -55 to +125degC; Packaging: Tape and Reel; Manufacturer Part Number: 885012006053; Published Date: May 2020; Ceramic Type: NP0; Height: 0.8mm; Mounting Technology: SMT; Size: 0603; Capacitance: 22pF
C41 = 885012107017: WCAP-CSGP Multilayer Ceramic Chip Capacitor, General Purpose, size 0805, X5R, 3.3uF, 25V; Manufacturer: Wurth Elektronik; Rated Voltage: 25VDC; Isolation Resistance: >=0.03GOhm; Capacitance Tolerance: +/-20%; Technical Reference: X5R0805335M025DFCT10000; ComponentLink1Description: Manufacturer; ComponentLink1URL: http://www.we-online.de; ComponentLink2Description: Datasheet; ComponentLink2URL: https://www.we-online.com/catalog/datasheet/885012107017.pdf; Operating Temperature: -55 to +85degC; Packaging: Tape and Reel; Manufacturer Part Number: 885012107017; Published Date: May 2020; Ceramic Type: X5R; Dissipation Factor: =<10%; Height: 1.25mm; Mounting Technology: SMT; Size: 0805; Capacitance: 3.3uF
C42-C45 = 885012106006: as C7 on sheet 04_ESP32_UART; ComponentLink1Description: Manufacturer; ComponentLink1URL: http://www.we-online.de; ComponentLink2Description: Datasheet; ComponentLink2URL: https://www.we-online.com/catalog/datasheet/885012106006.pdf; Operating Temperature: -55 to +85degC; Packaging: Tape and Reel; Manufacturer Part Number: 885012106006; Published Date: May 2020; Ceramic Type: X5R; Dissipation Factor: =<10%; Height: 0.8mm; Mounting Technology: SMT; Size: 0603; Capacitance: 10uF
C46 = 885012206040: WCAP-CSGP Multilayer Ceramic Chip Capacitor, General Purpose, size 0603, X7R, 10nF, 16V; Manufacturer: Wurth Elektronik; Rated Voltage: 16VDC; Isolation Resistance: >=10GOhm; Capacitance Tolerance: +/-10%; Technical Reference: X7R0603103K016DFCT10000; ComponentLink1Description: Manufacturer; ComponentLink1URL: http://www.we-online.de; ComponentLink2Description: Datasheet; ComponentLink2URL: https://www.we-online.com/catalog/datasheet/885012206040.pdf; Operating Temperature: -55 to +125degC; Packaging: Tape and Reel; Manufacturer Part Number: 885012206040; Published Date: May 2020; Ceramic Type: X7R; Dissipation Factor: =<3.5%; Height: 0.8mm; Mounting Technology: SMT; Size: 0603; Capacitance: 10nF
Y1 = 830108340809: WE-XTAL Quartz Crystal, SMT, CFPX-180, 25MHz, +/-20ppm; Manufacturer: Wurth Elektronik; Frequency Stability: +/-30ppm; Load Capacitance: 12pF; ComponentLink1Description: Manufacturer; ComponentLink1URL: http://www.we-online.de; ComponentLink2Description: Datasheet; ComponentLink2URL: https://www.we-online.com/catalog/datasheet/830108340809.pdf; Operating Temperature: -40 to +105degC; Packaging: Tape and Reel; Manufacturer Part Number: 830108340809; Published Date: November 2020; Size: CFPX-180; Frequency: 25MHz; Frequency Tolerance: +/-20ppm; Mounting Technology: SMT

## Sheet 08_Power_Supply.SchDoc
size A4; SheetNumber: 8; SheetTotal: 9
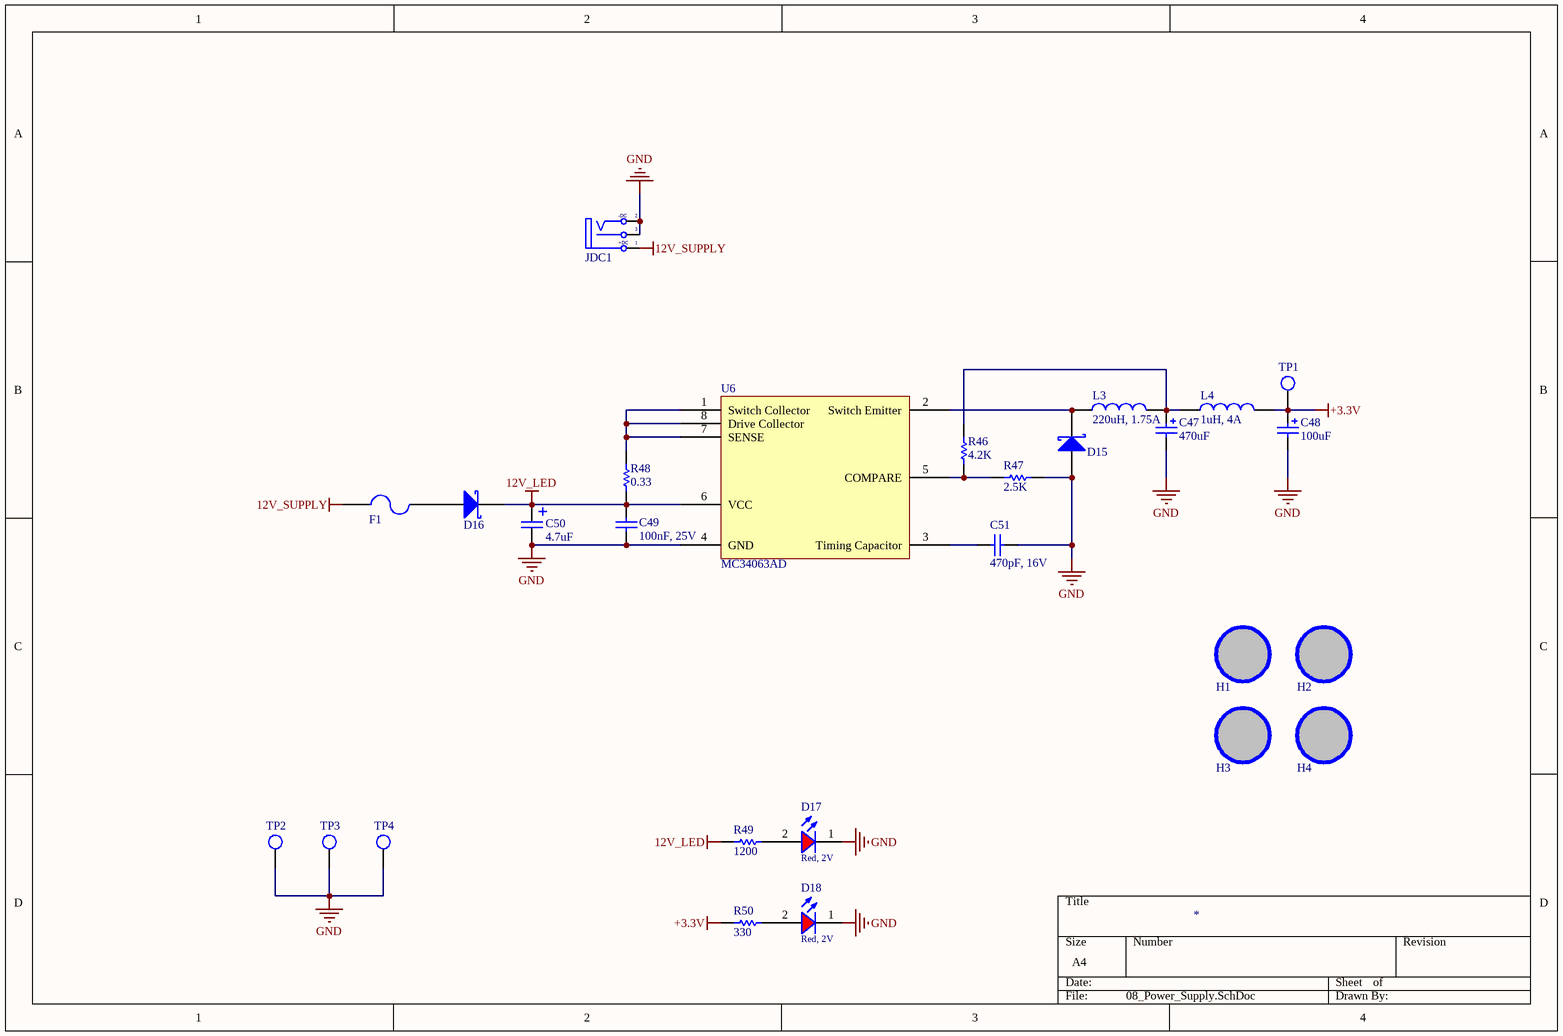
[diagram p6: 08_Power_Supply.SchDoc]

### Parts
C47  value 470uF  [CAP ALU SIZE F]  (hidden comment: Cap Pol SMD)
C48  value 100uF  [CAP ALU SIZE D]  (hidden comment: Cap Pol SMD)
C49  100nF, 25V  [WCAP-CSGP_0603_H=0.8mm_Reflow]
C50  value 4.7uF  [CAPMP3216X18N]  (hidden comment: Tantalum Capacitor)
C51  470pF, 16V  [WCAP-CSGP_0603_H=0.8mm_Reflow]
D15  D Schottky  [SS34]  (value not drawn)
D16  D Schottky  [SS34]  (value not drawn)
D17  Red, 2V  [WL-SMCW_0603_H=0.7mm]
D18  Red, 2V  [WL-SMCW_0603_H=0.7mm]
F1  Fuse  [FUSE SMD]  (value not drawn)
H1  Hole  [LO KHOAN 3MM]  (value not drawn)
H2  Hole  [LO KHOAN 3MM]  (value not drawn)
H3  Hole  [LO KHOAN 3MM]  (value not drawn)
H4  Hole  [LO KHOAN 3MM]  (value not drawn)
JDC1  Jack DC  [DC-IN]  (value not drawn)
L3  220uH, 1.75A  [WE-PD2A_5848]
L4  1uH, 4A  [WE-PD2A_4532]
R46  value 4.2K  [RES-SM-0603]  (hidden comment: RESISTOR SMD)
R47  value 2.5K  [RES-SM-0603]  (hidden comment: RESISTOR SMD)
R48  value 0.33  [RES-SM-0805]  (hidden comment: RESISTOR SMD)
R49  value 1200  [RES-SM-0603]  (hidden comment: RESISTOR SMD)
R50  value 330  [RES-SM-0603]  (hidden comment: RESISTOR SMD)
TP1  Test point  [TP]  (value not drawn)
TP2  Test point  [TP]  (value not drawn)
TP3  Test point  [TP]  (value not drawn)
TP4  Test point  [TP]  (value not drawn)
U6  MC34063AD  [SOIC127P600X170-8N]

### Nets
12V_LED: C49.2 C50.1 D16.2(K) R48.1 R49.2 U6.6(VCC)
12V_SUPPLY: F1.1 JDC1.1(T)
+3.3V: C48.1 L4.2 R50.2 TP1.1
GND: C47.2 C48.2 C49.1 C50.2 C51.2 D15.1(A) D17.1(K) D18.1(K) JDC1.2(TN) JDC1.3(S) R47.1 TP2.1 TP3.1 TP4.1 U6.4(GND)
NetC47_1: C47.1 L3.2 L4.1 R46.2
NetC51_1: C51.1 U6.3(Timing_Capacitor)
NetD15_2: D15.2(K) L3.1 U6.2(Switch_Emitter)
NetD16_1: D16.1(A) F1.2
NetD17_2: D17.2(A) R49.1
NetD18_2: D18.2(A) R50.1
NetR46_1: R46.1 R47.2 U6.5(COMPARE)
NetR48_2: R48.2 U6.1(Switch_Collector) U6.7(SENSE) U6.8(Drive_Collector)

Not connected (* = marked no-connect by the designer): H1 1; H2 1; H3 1; H4 1

### Notes on the sheet
- (in symbol Jack DC) -DC; +DC

### Library data of the parts
C47 C48 = Cap Pol SMD: Polarized Capacitor (Radial)
C49 = 885012206071: WCAP-CSGP Multilayer Ceramic Chip Capacitor, General Purpose, size 0603, X7R, 100nF, 25V; Manufacturer: Wurth Elektronik; Rated Voltage: 25VDC; Isolation Resistance: >=5GOhm; Capacitance Tolerance: +/-10%; Technical Reference: X7R0603104K025DFCT10000; ComponentLink1Description: Manufacturer; ComponentLink1URL: http://www.we-online.de; ComponentLink2Description: Datasheet; ComponentLink2URL: https://www.we-online.com/catalog/datasheet/885012206071.pdf; Operating Temperature: -55 to +125degC; Packaging: Tape and Reel; Manufacturer Part Number: 885012206071; Published Date: May 2020; Ceramic Type: X7R; Dissipation Factor: =<3.5%; Height: 0.8mm; Mounting Technology: SMT; Size: 0603; Capacitance: 100nF
C51 = 885012006027: WCAP-CSGP Multilayer Ceramic Chip Capacitor, General Purpose, size 0603, NP0, 470pF, 16V; Manufacturer: Wurth Elektronik; Rated Voltage: 16VDC; Isolation Resistance: >=10GOhm; Capacitance Tolerance: +/-5%; Dissipation Factor: Q>=1000; Technical Reference: NP00603471J016DFCT10000; ComponentLink1Description: Manufacturer; ComponentLink1URL: http://www.we-online.de; ComponentLink2Description: Datasheet; ComponentLink2URL: https://www.we-online.com/catalog/datasheet/885012006027.pdf; Operating Temperature: -55 to +125degC; Packaging: Tape and Reel; Manufacturer Part Number: 885012006027; Published Date: May 2020; Ceramic Type: NP0; Height: 0.8mm; Mounting Technology: SMT; Size: 0603; Capacitance: 470pF
D15 D16 = D Schottky: Schottky Diode; Published: 8-Jun-2000; LatestRevisionDate: 17-Jul-2002; LatestRevisionNote: Re-released for DXP Platform.; PackageReference: SMB; Publisher: Altium Limited; PackageDescription: DO-214-AA/SMB; 2 C-Bend Leads; Body 5.3 x 3.6 mm, inc. leads (LxW); Code_JEDEC: DO-214-AA
D17 D18 = 150060RS75000: as D4 on sheet 03_MCU_ESP32_Interface; Viewing Angle: 140deg; ComponentLink1Description: Manufacturer; ComponentLink1URL: http://www.we-online.de; ComponentLink2URL: https://www.we-online.com/catalog/datasheet/150060RS75000.pdf; ComponentLink2Description: Datasheet; Forward Voltage typ.: 2V; Emitting Color: Red; Mounting Technology: SMT; Operating Temperature: -40 to +85degC; Published Date: December 2019; Part Number: 150060RS75000; Packaging: Tape and Reel; Size: 0603; Publisher: Wurth Elektronik
H1-H4 = Hole: Hole 3mm
JDC1 = Jack DC: Jack DC input; Value: Jac DC
L3 = 784774222: WE-PD2A SMT Power Inductor, size 5848, 220uH, 0.41A; Manufacturer: Wurth Elektronik; DC Resistance max.: 1.57Ohm; Saturation Current: 0.47A; Self Resonant Frequency: 5MHz; DC Resistance typ.: 0.945Ohm; Rated Voltage: 80VDC; ComponentLink1Description: Manufacturer; ComponentLink1URL: http://www.we-online.de; ComponentLink2Description: Datasheet; ComponentLink2URL: https://www.we-online.com/catalog/datasheet/784774222.pdf; Manufacturer Part Number: 784774222; Published Date: May 2020; Rated Current: 0.41A; Inductance: 220uH; Operating Temperature: -40 to +125degC; Mounting Technology: SMT; Packaging: Tape and Reel; Size: 5848
L4 = 7847730: WE-PD2A SMT Power Inductor, size 4532, 1uH, 4A; Manufacturer: Wurth Elektronik; DC Resistance max.: 0.049Ohm; Saturation Current: 5.72A; Self Resonant Frequency: 110MHz; DC Resistance typ.: 0.014Ohm; Rated Voltage: 80VDC; ComponentLink1Description: Manufacturer; ComponentLink1URL: http://www.we-online.de; ComponentLink2Description: Datasheet; ComponentLink2URL: https://www.we-online.com/catalog/datasheet/7847730.pdf; Manufacturer Part Number: 7847730; Published Date: May 2020; Rated Current: 4A; Inductance: 1uH; Operating Temperature: -40 to +125degC; Mounting Technology: SMT; Packaging: Tape and Reel; Size: 4532
R46-R50 = RESISTOR SMD: Resistor
TP1-TP4 = TP: ComponentLink1Description: Supplier 1 Link
U6 = MC34063: 1.5-A boost, buck, inverting switching regulator, operation from 0°C to 70°C; Manufacturer: Texas Instruments; ComponentLink1Description: Local Supplier Link; ComponentLink1URL: https://www.thegioiic.com/products/mc34063ad-ic-dieu-chinh-tang-giam-ap-1-5a-8-soic; Local Supplier: Thegioiic; Local Supplier P/N: MC34063AD; Manufacturer P/N: MC34063AD

## Sheet 09_IO_Isolated_Interface.SchDoc
size A4; SheetNumber: 7; SheetTotal: 9
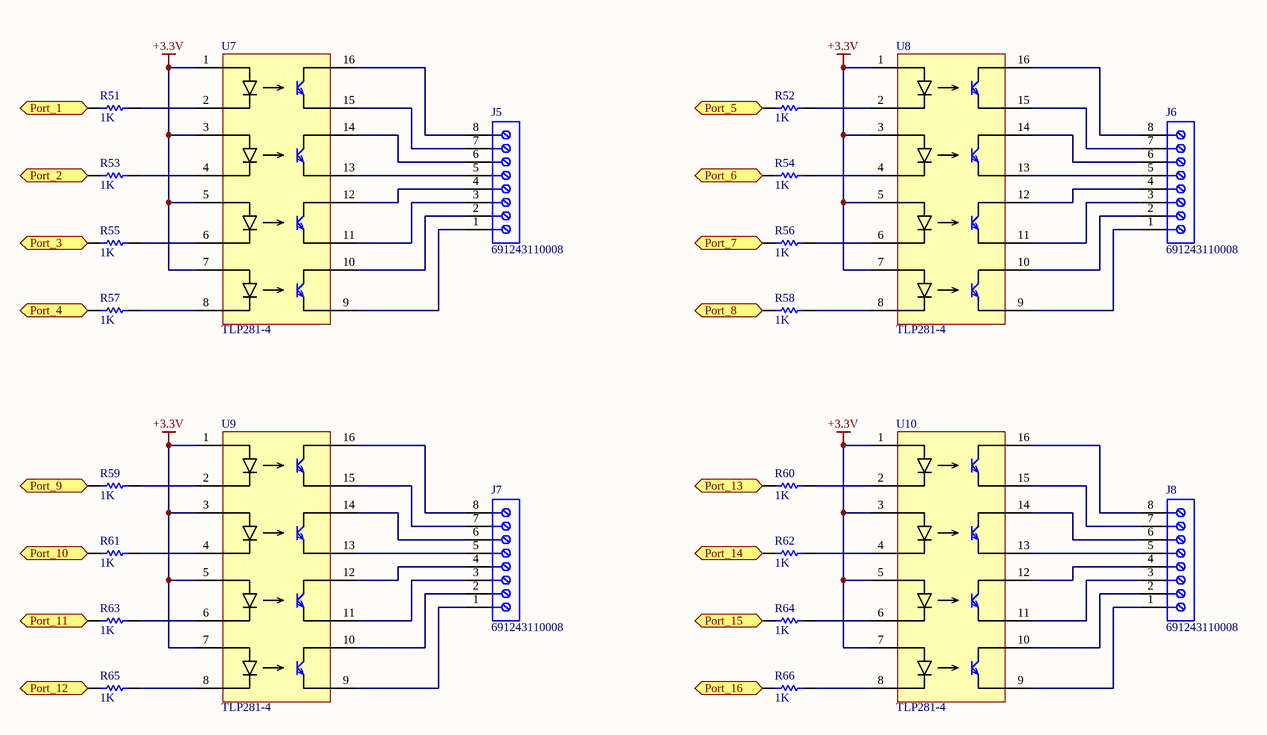
[diagram p7: 09_IO_Isolated_Interface.SchDoc]

### Parts
J5  691243110008  [691243110008]
J6  691243110008  [691243110008]
J7  691243110008  [691243110008]
J8  691243110008  [691243110008]
R51  value 1K  [RES-SM-0603]  (hidden comment: RESISTOR SMD)
R52  value 1K  [RES-SM-0603]  (hidden comment: RESISTOR SMD)
R53  value 1K  [RES-SM-0603]  (hidden comment: RESISTOR SMD)
R54  value 1K  [RES-SM-0603]  (hidden comment: RESISTOR SMD)
R55  value 1K  [RES-SM-0603]  (hidden comment: RESISTOR SMD)
R56  value 1K  [RES-SM-0603]  (hidden comment: RESISTOR SMD)
R57  value 1K  [RES-SM-0603]  (hidden comment: RESISTOR SMD)
R58  value 1K  [RES-SM-0603]  (hidden comment: RESISTOR SMD)
R59  value 1K  [RES-SM-0603]  (hidden comment: RESISTOR SMD)
R60  value 1K  [RES-SM-0603]  (hidden comment: RESISTOR SMD)
R61  value 1K  [RES-SM-0603]  (hidden comment: RESISTOR SMD)
R62  value 1K  [RES-SM-0603]  (hidden comment: RESISTOR SMD)
R63  value 1K  [RES-SM-0603]  (hidden comment: RESISTOR SMD)
R64  value 1K  [RES-SM-0603]  (hidden comment: RESISTOR SMD)
R65  value 1K  [RES-SM-0603]  (hidden comment: RESISTOR SMD)
R66  value 1K  [RES-SM-0603]  (hidden comment: RESISTOR SMD)
U7  TLP281-4  [SOIC127P700X210-16N]
U8  TLP281-4  [SOIC127P700X210-16N]
U9  TLP281-4  [SOIC127P700X210-16N]
U10  TLP281-4  [SOIC127P700X210-16N]

### Ports
Port_1 (bidir), Port_2 (bidir), Port_3 (bidir), Port_4 (bidir), Port_5 (bidir), Port_6 (bidir), Port_7 (bidir), Port_8 (bidir), Port_9 (bidir), Port_10 (bidir), Port_11 (bidir), Port_12 (bidir), Port_13 (bidir), Port_14 (bidir), Port_15 (bidir), Port_16 (bidir)

### Nets
+3.3V: U7.1(A1) U7.3(A2) U7.5(A3) U7.7(A4) U8.1(A1) U8.3(A2) U8.5(A3) U8.7(A4) U9.1(A1) U9.3(A2) U9.5(A3) U9.7(A4) U10.1(A1) U10.3(A2) U10.5(A3) U10.7(A4)
STM_PA15: R57.1 ; port Port_4
STM_PB3: R56.1 ; port Port_7
STM_PB4: R54.1 ; port Port_6
STM_PB5: R52.1 ; port Port_5
STM_PB6: R65.1 ; port Port_12
STM_PB7: R63.1 ; port Port_11
STM_PB8: R61.1 ; port Port_10
STM_PB9: R59.1 ; port Port_9
STM_PC0: R60.1 ; port Port_13
STM_PC10: R55.1 ; port Port_3
STM_PC11: R53.1 ; port Port_2
STM_PC12: R51.1 ; port Port_1
STM_PC13: R66.1 ; port Port_16
STM_PC14: R64.1 ; port Port_15
STM_PC15: R62.1 ; port Port_14
STM_PD2: R58.1 ; port Port_8
NetJ5_1: J5.1 U7.9(E4)
NetJ5_2: J5.2 U7.10(COL4)
NetJ5_3: J5.3 U7.11(E3)
NetJ5_4: J5.4 U7.12(COL3)
NetJ5_5: J5.5 U7.13(E2)
NetJ5_6: J5.6 U7.14(COL2)
NetJ5_7: J5.7 U7.15(E1)
NetJ5_8: J5.8 U7.16(COL1)
NetJ6_1: J6.1 U8.9(E4)
NetJ6_2: J6.2 U8.10(COL4)
NetJ6_3: J6.3 U8.11(E3)
NetJ6_4: J6.4 U8.12(COL3)
NetJ6_5: J6.5 U8.13(E2)
NetJ6_6: J6.6 U8.14(COL2)
NetJ6_7: J6.7 U8.15(E1)
NetJ6_8: J6.8 U8.16(COL1)
NetJ7_1: J7.1 U9.9(E4)
NetJ7_2: J7.2 U9.10(COL4)
NetJ7_3: J7.3 U9.11(E3)
NetJ7_4: J7.4 U9.12(COL3)
NetJ7_5: J7.5 U9.13(E2)
NetJ7_6: J7.6 U9.14(COL2)
NetJ7_7: J7.7 U9.15(E1)
NetJ7_8: J7.8 U9.16(COL1)
NetJ8_1: J8.1 U10.9(E4)
NetJ8_2: J8.2 U10.10(COL4)
NetJ8_3: J8.3 U10.11(E3)
NetJ8_4: J8.4 U10.12(COL3)
NetJ8_5: J8.5 U10.13(E2)
NetJ8_6: J8.6 U10.14(COL2)
NetJ8_7: J8.7 U10.15(E1)
NetJ8_8: J8.8 U10.16(COL1)
NetR51_2: R51.2 U7.2(C1)
NetR52_2: R52.2 U8.2(C1)
NetR53_2: R53.2 U7.4(C2)
NetR54_2: R54.2 U8.4(C2)
NetR55_2: R55.2 U7.6(C3)
NetR56_2: R56.2 U8.6(C3)
NetR57_2: R57.2 U7.8(C4)
NetR58_2: R58.2 U8.8(C4)
NetR59_2: R59.2 U9.2(C1)
NetR60_2: R60.2 U10.2(C1)
NetR61_2: R61.2 U9.4(C2)
NetR62_2: R62.2 U10.4(C2)
NetR63_2: R63.2 U9.6(C3)
NetR64_2: R64.2 U10.6(C3)
NetR65_2: R65.2 U9.8(C4)
NetR66_2: R66.2 U10.8(C4)

### Library data of the parts
J5-J8 = 691243110008: WR-TBL Serie 2431 Horizontal Cable Entry, Rising Cage Clamp, pitch 3.5mm, 8p; Compliance: Lead free / RoHS; Modularity: No; PCB/Cable/Panel: PCB; Pin Number: 8; Rated Current [UL]: 10A; Working Voltage [UL]: 300VAC; ComponentLink1Description: Manufacturer; ComponentLink1URL: http://www.we-online.de; ComponentLink2URL: https://katalog.we-online.de/em/datasheet/691243110008.pdf; ComponentLink2Description: Datasheet; Mounting Technology: THT; Part Number: 691243110008; Packaging: Box; Operating Temperature: -30 to +120degC; Pitch: 3.5mm; Published Date: October 2019; Type: Horizontal; Publisher: Wurth Elektronik; Application: Rising Cage Clamp
R51-R66 = RESISTOR SMD: Resistor

## Sheet 10_CAN_Interface.SchDoc
size A4
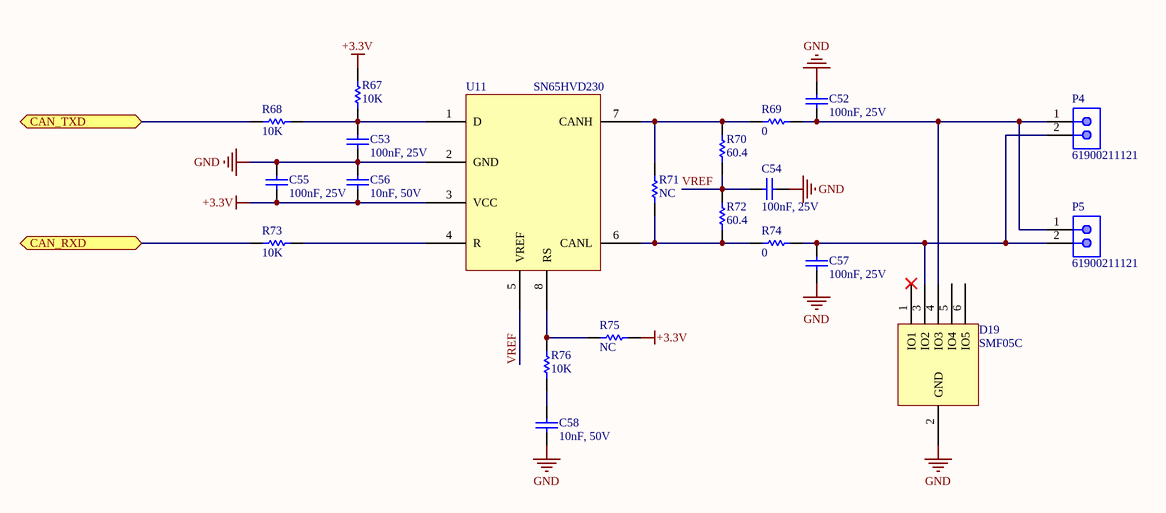
[diagram p8: 10_CAN_Interface.SchDoc]

### Parts
C52  100nF, 25V  [WCAP-CSGP_0603_H=0.8mm_Reflow]
C53  100nF, 25V  [WCAP-CSGP_0603_H=0.8mm_Reflow]
C54  100nF, 25V  [WCAP-CSGP_0603_H=0.8mm_Reflow]
C55  100nF, 25V  [WCAP-CSGP_0603_H=0.8mm_Reflow]
C56  10nF, 50V  [WCAP-CSGP_0603_H=0.8mm_Reflow]
C57  100nF, 25V  [WCAP-CSGP_0603_H=0.8mm_Reflow]
C58  10nF, 50V  [WCAP-CSGP_0603_H=0.8mm_Reflow]
D19  SMF05C  [SOT65P210X110-6N]
P4  61900211121  [61900211121]
P5  61900211121  [61900211121]
R67  value 10K  [RES-SM-0603]  (hidden comment: RESISTOR SMD)
R68  value 10K  [RES-SM-0603]  (hidden comment: RESISTOR SMD)
R69  value 0  [RES-SM-0603]  (hidden comment: RESISTOR SMD)
R70  value 60.4  [RES-SM-0603]  (hidden comment: RESISTOR SMD)
R71  value NC  [RES-SM-0603]  (hidden comment: RESISTOR SMD)
R72  value 60.4  [RES-SM-0603]  (hidden comment: RESISTOR SMD)
R73  value 10K  [RES-SM-0603]  (hidden comment: RESISTOR SMD)
R74  value 0  [RES-SM-0603]  (hidden comment: RESISTOR SMD)
R75  value NC  [RES-SM-0603]  (hidden comment: RESISTOR SMD)
R76  value 10K  [RES-SM-0603]  (hidden comment: RESISTOR SMD)
U11  SN65HVD230  [SOIC127P600X175-8N]

### Ports
CAN_RXD (bidir), CAN_TXD (bidir)

### Nets
+3.3V: C55.1 C56.1 R67.2 R75.1 U11.3(VCC)
GND: C52.2 C53.1 C54.1 C55.2 C56.2 C57.1 C58.1 D19.2(GND) U11.2(GND)
VREF: C54.2 R70.2 R72.1 U11.5(VREF)
NetC52_1: C52.1 D19.4(IO3) P4.1 P5.1 R69.1
NetC53_2: C53.2 R67.1 R68.1 U11.1(D)
NetC57_2: C57.2 D19.3(IO2) P4.2 P5.2 R74.1
NetC58_2: C58.2 R76.1
NetR7_2: R73.2 ; port CAN_RXD
NetR8_2: R68.2 ; port CAN_TXD
NetR69_2: R69.2 R70.1 R71.1 U11.7(CANH)
NetR71_2: R71.2 R72.2 R74.2 U11.6(CANL)
NetR73_1: R73.1 U11.4(R)
NetR75_2: R75.2 R76.2 U11.8(RS)

Not connected (* = marked no-connect by the designer): D19 1(IO1)* 5(IO4) 6(IO5)

### Library data of the parts
C52-C55 C57 = 885012206071: as C49 on sheet 08_Power_Supply; ComponentLink1Description: Manufacturer; ComponentLink1URL: http://www.we-online.de; ComponentLink2Description: Datasheet; ComponentLink2URL: https://www.we-online.com/catalog/datasheet/885012206071.pdf; Operating Temperature: -55 to +125degC; Packaging: Tape and Reel; Manufacturer Part Number: 885012206071; Published Date: May 2020; Ceramic Type: X7R; Dissipation Factor: =<3.5%; Height: 0.8mm; Mounting Technology: SMT; Size: 0603; Capacitance: 100nF
C56 C58 = 885012206089: as C6 on sheet 03_MCU_ESP32_Interface; ComponentLink1Description: Manufacturer; ComponentLink1URL: http://www.we-online.de; ComponentLink2Description: Datasheet; ComponentLink2URL: https://www.we-online.com/catalog/datasheet/885012206089.pdf; Operating Temperature: -55 to +125degC; Packaging: Tape and Reel; Manufacturer Part Number: 885012206089; Published Date: May 2020; Ceramic Type: X7R; Dissipation Factor: =<2.5%; Height: 0.8mm; Mounting Technology: SMT; Size: 0603; Capacitance: 10nF
P4 P5 = 61900211121: WR-WTB THT Male Vertical Locking Header, pitch 2.54mm, 2p; Pin Number: 2; Contact Resistance: 20mOhm; Rated Current: 3A; Withstanding Voltage: 1000VAC; Working Voltage: 250VAC; ComponentLink1Description: Manufacturer; ComponentLink1URL: http://www.we-online.de; ComponentLink2Description: Datasheet; ComponentLink2URL: https://www.we-online.com/catalog/datasheet/61900211121.pdf; Pitch: 2.54mm; Published Date: January 2020; Publisher: Wurth Elektronik; Mounting Technology: THT; Packaging: Bag; Operating Temperature: -40 to +105degC; Part Number: 61900211121; Gender: Male; Type: Vertical
R67-R76 = RESISTOR SMD: Resistor

## Nets that join several sheets
+3.3V: 03_MCU_ESP32_Interface (12 pins), 04_ESP32_UART (6 pins), 05_MCU_STM32F4_Interface (25 pins), 06_STM43F4_UART (8 pins), 08_Power_Supply (C48.1 L4.2 R50.2 TP1.1), 09_IO_Isolated_Interface (16 pins), 10_CAN_Interface (5 pins)
GND: 03_MCU_ESP32_Interface (12 pins), 04_ESP32_UART (7 pins), 05_MCU_STM32F4_Interface (25 pins), 06_STM43F4_UART (7 pins), 07_Ethernet_Interface (30 pins), 08_Power_Supply (15 pins), 10_CAN_Interface (9 pins)
ESP_GPIO_17: 03_MCU_ESP32_Interface (U1.20), 05_MCU_STM32F4_Interface (U3.17)
ESP_GPIO_18: 03_MCU_ESP32_Interface (R5.1 U1.21), 05_MCU_STM32F4_Interface (U3.16)
ESP_GPIO_34: 03_MCU_ESP32_Interface (U1.28), 07_Ethernet_Interface (U5.29)
ESP_GPIO_35: 03_MCU_ESP32_Interface (U1.29), 07_Ethernet_Interface (U5.27)
ESP_GPIO_36: 03_MCU_ESP32_Interface (U1.30), 07_Ethernet_Interface (U5.30)
ESP_GPIO_37: 03_MCU_ESP32_Interface (U1.31), 07_Ethernet_Interface (U5.28)
ESP_RST: 03_MCU_ESP32_Interface (C2.2 R2.1 R6.1 U1.41), 05_MCU_STM32F4_Interface (C15.2 R19.1 SW2.2 U3.7)
NetD10_1: 05_MCU_STM32F4_Interface (U3.42), 06_STM43F4_UART (D10.1 U4.25)
NetD11_1: 05_MCU_STM32F4_Interface (U3.43), 06_STM43F4_UART (D11.1 U4.26)
NetR2_2: 03_MCU_ESP32_Interface (R2.2), 04_ESP32_UART (R13.2)
NetR3_2: 03_MCU_ESP32_Interface (R3.2), 04_ESP32_UART (R18.2)
NetR7_2: 03_MCU_ESP32_Interface (R7.2), 05_MCU_STM32F4_Interface (R25.2 R26.2), 10_CAN_Interface (R73.2)
NetR8_2: 03_MCU_ESP32_Interface (R8.2), 05_MCU_STM32F4_Interface (R27.2 R28.2), 10_CAN_Interface (R68.2)
NetU1_37: 03_MCU_ESP32_Interface (U1.37), 04_ESP32_UART (U2.25)
NetU1_38: 03_MCU_ESP32_Interface (U1.38), 04_ESP32_UART (U2.26)
STM_PA15: 05_MCU_STM32F4_Interface (U3.50), 09_IO_Isolated_Interface (R57.1)
STM_PB3: 05_MCU_STM32F4_Interface (U3.55), 09_IO_Isolated_Interface (R56.1)
STM_PB4: 05_MCU_STM32F4_Interface (U3.56), 09_IO_Isolated_Interface (R54.1)
STM_PB5: 05_MCU_STM32F4_Interface (U3.57), 09_IO_Isolated_Interface (R52.1)
STM_PB6: 05_MCU_STM32F4_Interface (U3.58), 09_IO_Isolated_Interface (R65.1)
STM_PB7: 05_MCU_STM32F4_Interface (U3.59), 09_IO_Isolated_Interface (R63.1)
STM_PB8: 05_MCU_STM32F4_Interface (U3.61), 09_IO_Isolated_Interface (R61.1)
STM_PB9: 05_MCU_STM32F4_Interface (U3.62), 09_IO_Isolated_Interface (R59.1)
STM_PC0: 05_MCU_STM32F4_Interface (U3.8), 09_IO_Isolated_Interface (R60.1)
STM_PC10: 05_MCU_STM32F4_Interface (U3.51), 09_IO_Isolated_Interface (R55.1)
STM_PC11: 05_MCU_STM32F4_Interface (U3.52), 09_IO_Isolated_Interface (R53.1)
STM_PC12: 05_MCU_STM32F4_Interface (U3.53), 09_IO_Isolated_Interface (R51.1)
STM_PC13: 05_MCU_STM32F4_Interface (U3.2), 09_IO_Isolated_Interface (R66.1)
STM_PC14: 05_MCU_STM32F4_Interface (U3.3), 09_IO_Isolated_Interface (R64.1)
STM_PC15: 05_MCU_STM32F4_Interface (U3.4), 09_IO_Isolated_Interface (R62.1)
STM_PD2: 05_MCU_STM32F4_Interface (U3.54), 09_IO_Isolated_Interface (R58.1)